# Altium project XTRXr5.PRJPCB (part 1 of 2)
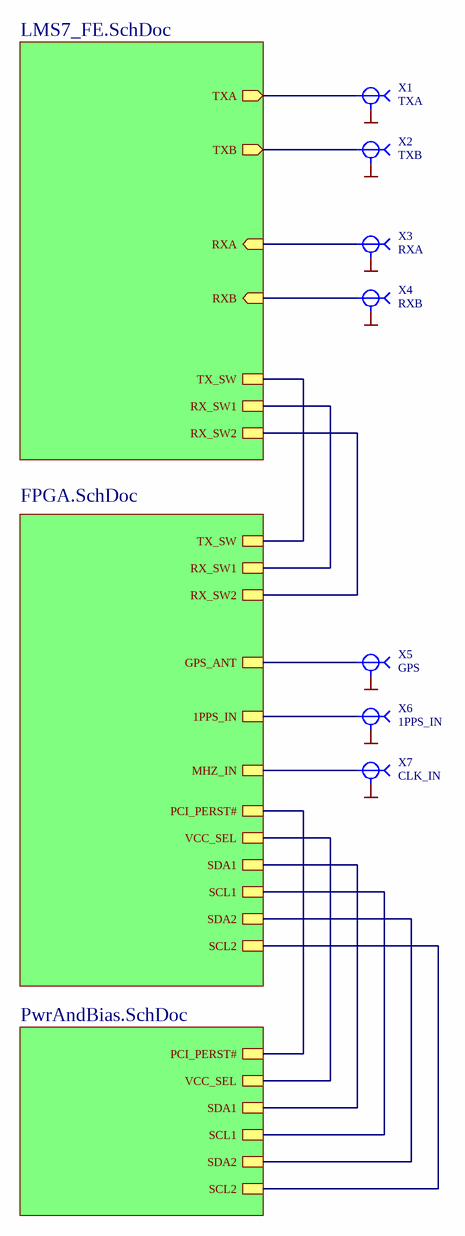
[diagram p0: Total.SchDoc]
ProjectRevision: 5
4 sheets, 367 parts. Net scope: hierarchical (ports join the sheet entries above them; power ports are global).
Board file: XTRXr5.PcbDoc
Sheets:
  Total.SchDoc
    PwrAndBias = PwrAndBias.SchDoc
    FPGA = FPGA.SchDoc
  Func Diagram.SchDoc

## Sheet Total.SchDoc: XTRX. SDR mini PCIe Transceiver.
size A4 portrait; CompanyName: Fairwaves Inc; DrawnBy: Andrey Sviyazov; Revision: 4; SheetNumber: 2; SheetTotal: 5

### Parts
X1  Label: TXA  [U_FL]
X2  Label: TXB  [U_FL]
X3  Label: RXA  [U_FL]
X4  Label: RXB  [U_FL]
X5  Label: GPS  [U_FL]
X6  Label: 1PPS_IN  [U_FL]
X7  Label: CLK_IN  [U_FL]

### Sub-sheets
FPGA = FPGA.SchDoc: 1PPS_IN, GPS_ANT, MHZ_IN, RX_SW1, RX_SW2, TX_SW, SCL1, SDA1, SDA2, SCL2, VCC_SEL, PCI_PERST#
LMS7_FE = LMS7_FE.SchDoc (file not in this document): TXB (out), TXA (out), RXB (in), RXA (in), RX_SW1, RX_SW2, TX_SW
PwrAndBias = PwrAndBias.SchDoc: SCL1, SDA1, SDA2, SCL2, VCC_SEL, PCI_PERST#

### Nets
GND: X1.2(GND) X2.2(GND) X3.2(GND) X4.2(GND) X5.2(GND) X6.2(GND) X7.2(GND)
1PPS_IN: X6.1 ; sheet FPGA/1PPS_IN
GPS_ANT: X5.1 ; sheet FPGA/GPS_ANT
MHZ_IN: X7.1 ; sheet FPGA/MHZ_IN
PCI_PERST#: sheet PwrAndBias/PCI_PERST#, sheet FPGA/PCI_PERST#
RX_SW1: sheet FPGA/RX_SW1, sheet LMS7_FE/RX_SW1
RX_SW2: sheet FPGA/RX_SW2, sheet LMS7_FE/RX_SW2
SCL1: sheet PwrAndBias/SCL1, sheet FPGA/SCL1
SCL2: sheet PwrAndBias/SCL2, sheet FPGA/SCL2
SDA1: sheet PwrAndBias/SDA1, sheet FPGA/SDA1
SDA2: sheet PwrAndBias/SDA2, sheet FPGA/SDA2
TX_SW: sheet FPGA/TX_SW, sheet LMS7_FE/TX_SW
VCC_SEL: sheet PwrAndBias/VCC_SEL, sheet FPGA/VCC_SEL
NetX1_1: X1.1 ; sheet LMS7_FE/TXA
NetX2_1: X2.1 ; sheet LMS7_FE/TXB
NetX3_1: X3.1 ; sheet LMS7_FE/RXA
NetX4_1: X4.1 ; sheet LMS7_FE/RXB

### Library data of the parts
X1-X7 = U_FL: Connector (UMCC); Manufacturer: Molex; Name: UFL; Value: 0734120110; Link: https://octopart.com/0734120110-molex-16756629

## Sheet PwrAndBias.SchDoc: XTRX. SDR mini PCIe Transceiver.
size A3; CompanyName: Fairwaves Inc.; DrawnBy: Andrey Sviyazov; Revision: 4; SheetNumber: 4; SheetTotal: 5
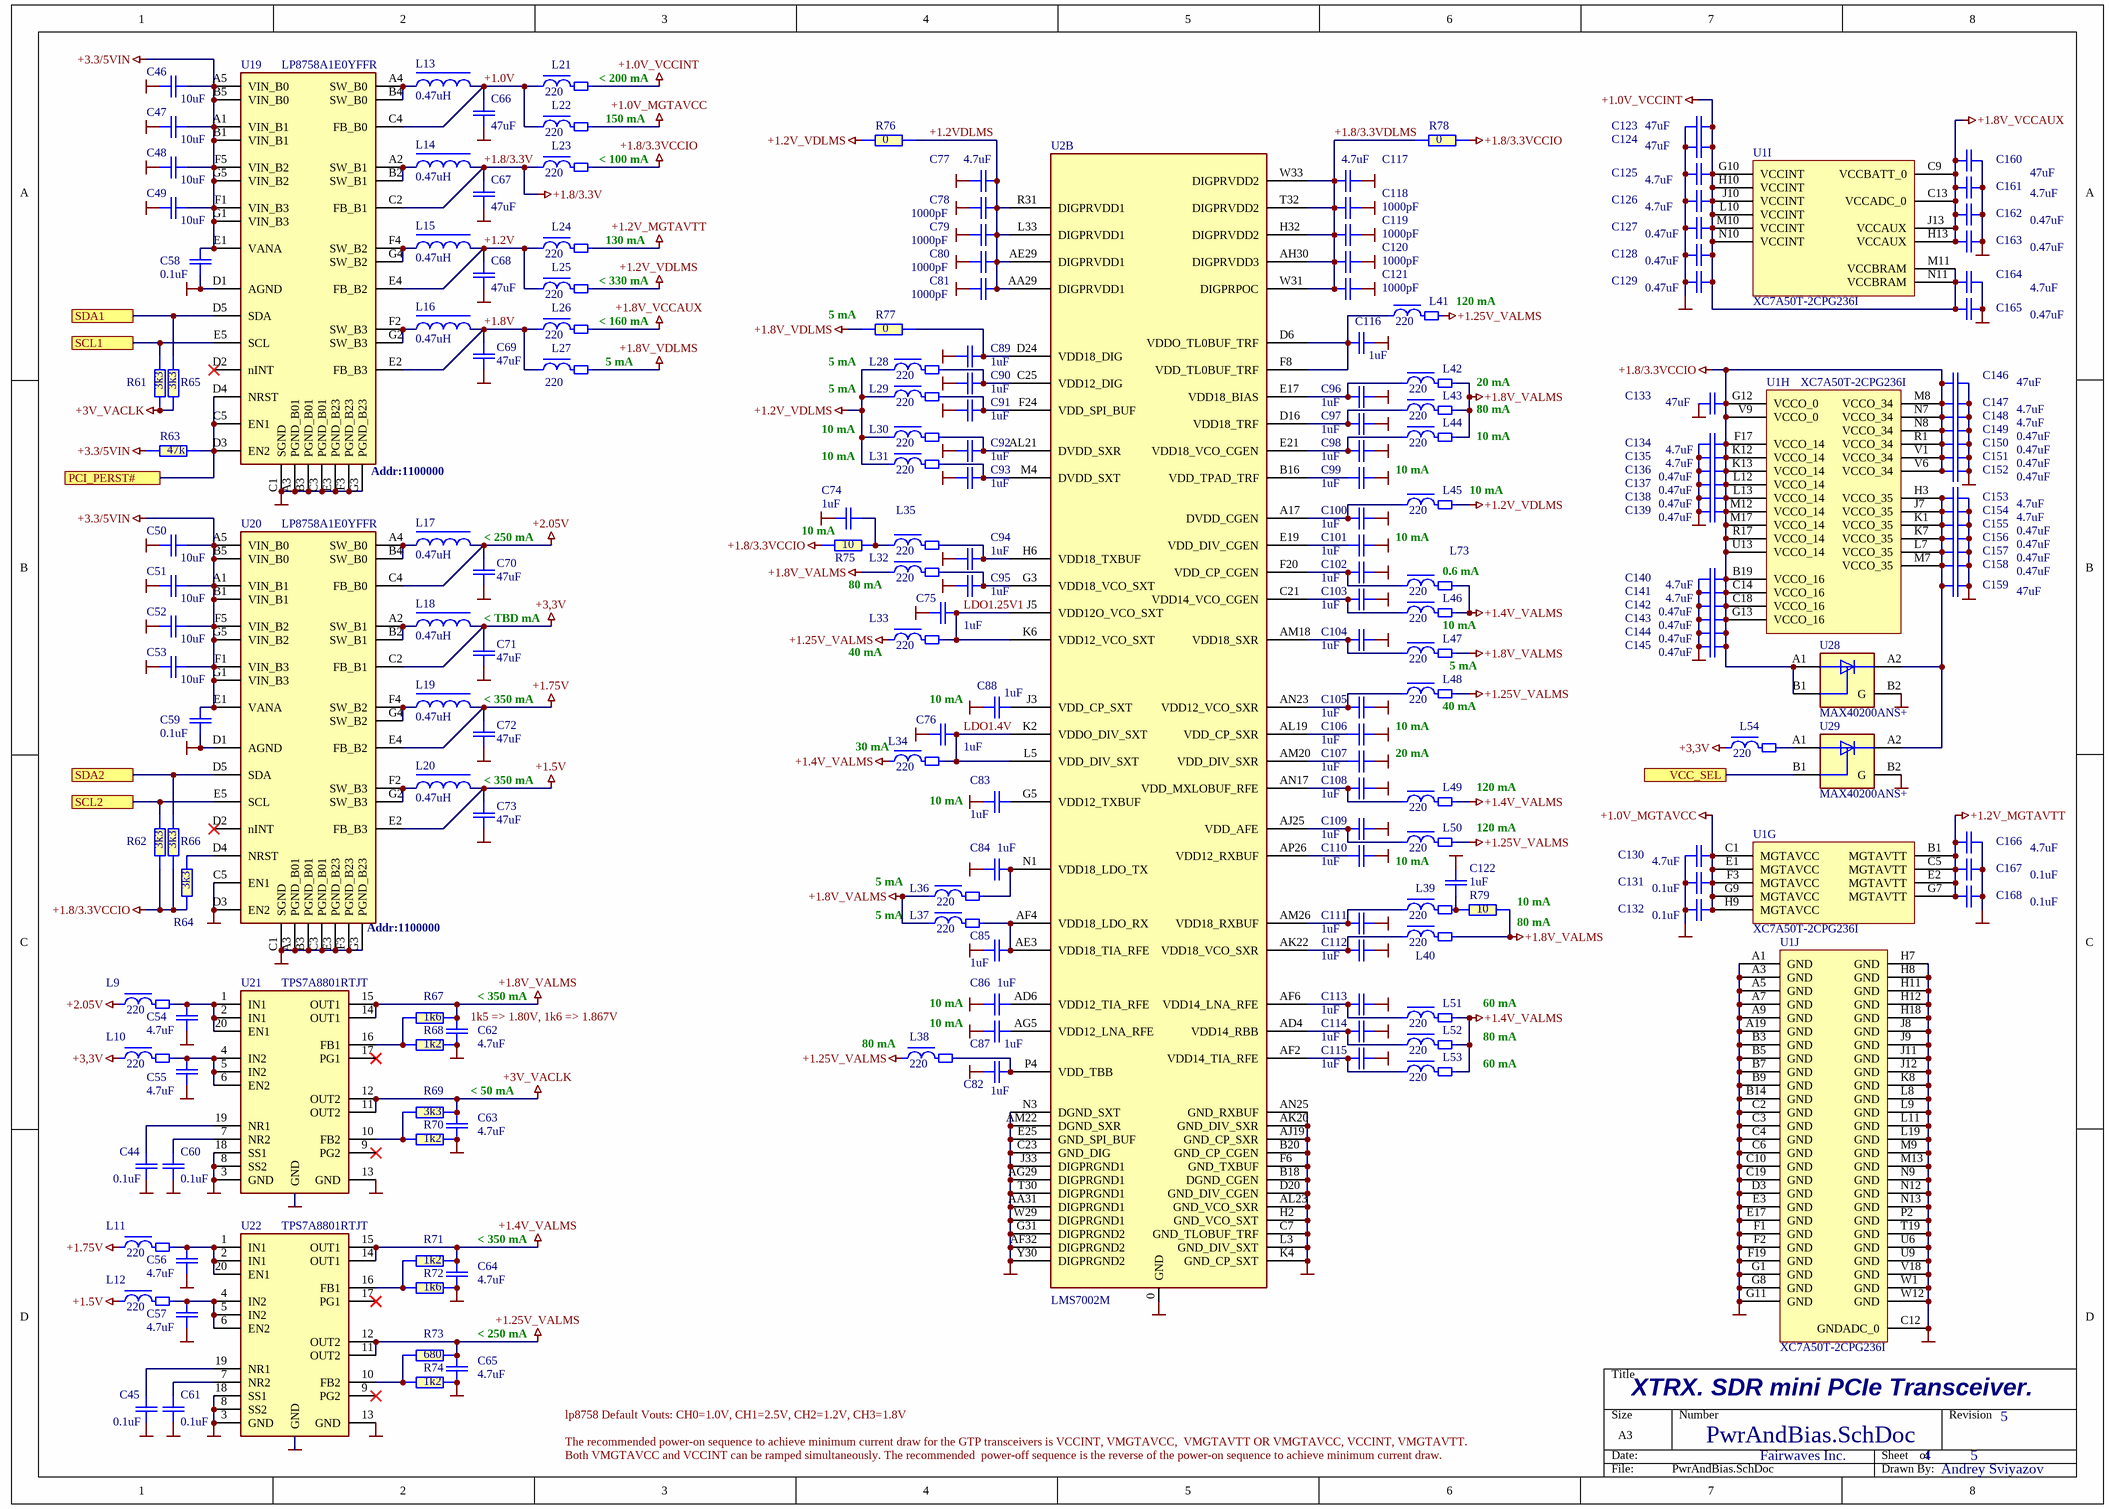
[diagram p1: PwrAndBias.SchDoc]

### Parts
C44  0.1uF  [C0402-cirq]
C45  0.1uF  [C0402-cirq]
C46  10uF  [C0603-Phillips]
C47  10uF  [C0603-Phillips]
C48  10uF  [C0603-Phillips]
C49  10uF  [C0603-Phillips]
C50  10uF  [C0603-Phillips]
C51  10uF  [C0603-Phillips]
C52  10uF  [C0603-Phillips]
C53  10uF  [C0603-Phillips]
C54  4.7uF  [C0402-cirq]
C55  4.7uF  [C0402-cirq]
C56  4.7uF  [C0402-cirq]
C57  4.7uF  [C0402-cirq]
C58  0.1uF  [C0402-cirq]
C59  0.1uF  [C0402-cirq]
C60  0.1uF  [C0402-cirq]
C61  0.1uF  [C0402-cirq]
C62  4.7uF  [C0402-cirq]
C63  4.7uF  [C0402-cirq]
C64  4.7uF  [C0402-cirq]
C65  4.7uF  [C0402-cirq]
C66  47uF  [C0603 tall]
C67  47uF  [C0603 tall]
C68  47uF  [C0603 tall]
C69  47uF  [C0603 tall]
C70  47uF  [C0603 tall]
C71  47uF  [C0603 tall]
C72  47uF  [C0603 tall]
C73  47uF  [C0603 tall]
C74  1uF  [C0402-cirq]
C75  1uF  [C0402-cirq]
C76  1uF  [C0402-cirq]
C77  4.7uF  [C0402-cirq]
C78  1000pF  [C0402-cirq]
C79  1000pF  [C0402-cirq]
C80  1000pF  [C0402-cirq]
C81  1000pF  [C0402-cirq]
C82  1uF  [C0402-cirq]
C83  1uF  [C0402-cirq]
C84  1uF  [C0402-cirq]
C85  1uF  [C0402-cirq]
C86  1uF  [C0402-cirq]
C87  1uF  [C0402-cirq]
C88  1uF  [C0402-cirq]
C89  1uF  [C0402-cirq]
C90  1uF  [C0402-cirq]
C91  1uF  [C0402-cirq]
C92  1uF  [C0402-cirq]
C93  1uF  [C0402-cirq]
C94  1uF  [C0402-cirq]
C95  1uF  [C0402-cirq]
C96  1uF  [C0402-cirq]
C97  1uF  [C0402-cirq]
C98  1uF  [C0402-cirq]
C99  1uF  [C0402-cirq]
C100  1uF  [C0402-cirq]
C101  1uF  [C0402-cirq]
C102  1uF  [C0402-cirq]
C103  1uF  [C0402-cirq]
C104  1uF  [C0402-cirq]
C105  1uF  [C0402-cirq]
C106  1uF  [C0402-cirq]
C107  1uF  [C0402-cirq]
C108  1uF  [C0402-cirq]
C109  1uF  [C0402-cirq]
C110  1uF  [C0402-cirq]
C111  1uF  [C0402-cirq]
C112  1uF  [C0402-cirq]
C113  1uF  [C0402-cirq]
C114  1uF  [C0402-cirq]
C115  1uF  [C0402-cirq]
C116  1uF  [C0402-cirq]
C117  4.7uF  [C0402-cirq]
C118  1000pF  [C0402-cirq]
C119  1000pF  [C0402-cirq]
C120  1000pF  [C0402-cirq]
C121  1000pF  [C0402-cirq]
C122  1uF  [C0402-cirq]
C123  47uF  [C0603 tall]
C124  47uF  [C0603 tall]
C125  4.7uF  [C0402-cirq]
C126  4.7uF  [C0402-cirq]
C127  0.47uF  [C0402-cirq]
C128  0.47uF  [C0402-cirq]
C129  0.47uF  [C0402-cirq]
C130  4.7uF  [C0402-cirq]
C131  0.1uF  [C0402-cirq]
C132  0.1uF  [C0402-cirq]
C133  47uF  [C0603 tall]
C134  4.7uF  [C0402-cirq]
C135  4.7uF  [C0402-cirq]
C136  0.47uF  [C0402-cirq]
C137  0.47uF  [C0402-cirq]
C138  0.47uF  [C0402-cirq]
C139  0.47uF  [C0402-cirq]
C140  4.7uF  [C0402-cirq]
C141  4.7uF  [C0402-cirq]
C142  0.47uF  [C0402-cirq]
C143  0.47uF  [C0402-cirq]
C144  0.47uF  [C0402-cirq]
C145  0.47uF  [C0402-cirq]
C146  47uF  [C0603 tall]
C147  4.7uF  [C0402-cirq]
C148  4.7uF  [C0402-cirq]
C149  0.47uF  [C0402-cirq]
C150  0.47uF  [C0402-cirq]
C151  0.47uF  [C0402-cirq]
C152  0.47uF  [C0402-cirq]
C153  4.7uF  [C0402-cirq]
C154  4.7uF  [C0402-cirq]
C155  0.47uF  [C0402-cirq]
C156  0.47uF  [C0402-cirq]
C157  0.47uF  [C0402-cirq]
C158  0.47uF  [C0402-cirq]
C159  47uF  [C0603 tall]
C160  47uF  [C0603 tall]
C161  4.7uF  [C0402-cirq]
C162  0.47uF  [C0402-cirq]
C163  0.47uF  [C0402-cirq]
C164  4.7uF  [C0402-cirq]
C165  0.47uF  [C0402-cirq]
C166  4.7uF  [C0402-cirq]
C167  0.1uF  [C0402-cirq]
C168  0.1uF  [C0402-cirq]
L9  220  [BEAD0402-Phillips]
L10  220  [BEAD0402-Phillips]
L11  220  [BEAD0402-Phillips]
L12  220  [BEAD0402-Phillips]
L13  0.47uH  [L-VLS201610HBX]
L14  0.47uH  [L-VLS201610HBX]
L15  0.47uH  [L-VLS201610HBX]
L16  0.47uH  [L-VLS201610HBX]
L17  0.47uH  [L-VLS201610HBX]
L18  0.47uH  [L-VLS201610HBX]
L19  0.47uH  [L-VLS201610HBX]
L20  0.47uH  [L-VLS201610HBX]
L21  220  [BEAD0402-Phillips]
L22  220  [BEAD0402-Phillips]
L23  220  [BEAD0402-Phillips]
L24  220  [BEAD0402-Phillips]
L25  220  [BEAD0402-Phillips]
L26  220  [BEAD0402-Phillips]
L27  220  [BEAD0402-Phillips]
L28  220  [BEAD0402-Phillips]
L29  220  [BEAD0402-Phillips]
L30  220  [BEAD0402-Phillips]
L31  220  [BEAD0402-Phillips]
L32  220  [BEAD0402-Phillips]
L33  220  [BEAD0402-Phillips]
L34  220  [BEAD0402-Phillips]
L35  220  [BEAD0402-Phillips]
L36  220  [BEAD0402-Phillips]
L37  220  [BEAD0402-Phillips]
L38  220  [BEAD0402-Phillips]
L39  220  [BEAD0402-Phillips]
L40  220  [BEAD0402-Phillips]
L41  220  [BEAD0402-Phillips]
L42  220  [BEAD0402-Phillips]
L43  220  [BEAD0402-Phillips]
L44  220  [BEAD0402-Phillips]
L45  220  [BEAD0402-Phillips]
L46  220  [BEAD0402-Phillips]
L47  220  [BEAD0402-Phillips]
L48  220  [BEAD0402-Phillips]
L49  220  [BEAD0402-Phillips]
L50  220  [BEAD0402-Phillips]
L51  220  [BEAD0402-Phillips]
L52  220  [BEAD0402-Phillips]
L53  220  [BEAD0402-Phillips]
L54  220  [BEAD0402-Phillips]
L73  220  [BEAD0402-Phillips]
R61  3k3  [R0402-Phillips]
R62  3k3  [R0402-Phillips]
R63  47k  [R0402-Phillips]
R64  3k3  [R0402-Phillips]
R65  3k3  [R0402-Phillips]
R66  3k3  [R0402-Phillips]
R67  1k6  [R0402-Phillips]
R68  1k2  [R0402-Phillips]
R69  3k3  [R0402-Phillips]
R70  1k2  [R0402-Phillips]
R71  1k2  [R0402-Phillips]
R72  1k6  [R0402-Phillips]
R73  680  [R0402-Phillips]
R74  1k2  [R0402-Phillips]
R75  10  [R0402-Phillips]
R76  0  [R0402-Phillips]
R77  0  [R0402-Phillips]
R78  0  [R0402-Phillips]
R79  10  [R0402-Phillips]
U1  XC7A50T-2CPG236I  [CPG236]  (parts G,H,I,J of 10)
U2  LMS7002M  [aQFN260(11.5x11.5mm)]  (part B of 5)
U19  LP8758A1E0YFFR  [BGA WLCSP35]
U20  LP8758A1E0YFFR  [BGA WLCSP35]
U21  TPS7A8801RTJT  [QFN-20(4X4/0.5)TI]
U22  TPS7A8801RTJT  [QFN-20(4X4/0.5)TI]
U28  MAX40200ANS+  [BGA WLP4 (0.7x0.7/0.35)]
U29  MAX40200ANS+  [BGA WLP4 (0.7x0.7/0.35)]

### Ports
PCI_PERST#, SCL1, SCL2, SDA1, SDA2, VCC_SEL

### Nets
+1.0V_MGTAVCC: C130.2 C131.1 C132.1 L22.2 U1.C1(MGTAVCC) U1.E1(MGTAVCC) U1.F3(MGTAVCC) U1.G9(MGTAVCC) U1.H9(MGTAVCC)
+1.0V_VCCINT: C123.2 C124.2 C125.1 C126.1 C127.1 C128.1 C129.1 C164.1 C165.1 L21.2 U1.G10(VCCINT) U1.H10(VCCINT) U1.J10(VCCINT) U1.L10(VCCINT) U1.M10(VCCINT) U1.M11(VCCBRAM) U1.N10(VCCINT) U1.N11(VCCBRAM)
+1.2V_MGTAVTT: C166.1 C167.1 C168.1 L24.2 U1.B1(MGTAVTT) U1.C5(MGTAVTT) U1.E2(MGTAVTT) U1.G7(MGTAVTT)
+1.2V_VDLMS: L25.2 L28.1 L29.1 L30.1 L31.1 L45.2 R76.1
+1.4V_VALMS: C64.2 L34.1 L46.2 L49.2 L51.2 L52.2 L53.2 L73.2 R71.2 U22.14(OUT1) U22.15(OUT1)
+1.5V: C73.2 L12.1 L20.2 U20.E2(FB_B3)
+1.8/3.3V: C67.2 L14.2 L23.1 U19.C2(FB_B1)
+1.8/3.3VCCIO: C133.2 C134.1 C135.1 C136.1 C137.1 C138.1 C139.1 C140.1 C141.1 C142.1 C143.1 C144.1 C145.1 C146.1 C147.1 C148.1 C149.1 C150.1 C151.1 C152.1 L23.2 R62.1 R64.1 R66.1 R75.1 R78.2 U1.B19(VCCO_16) U1.C14(VCCO_16) U1.C18(VCCO_16) U1.F17(VCCO_14) U1.G12(VCCO_0) U1.G13(VCCO_16) U1.K12(VCCO_14) U1.K13(VCCO_14) U1.L12(VCCO_14) U1.L13(VCCO_14) U1.M8(VCCO_34) U1.M12(VCCO_14) U1.M17(VCCO_14) U1.N7(VCCO_34) U1.N8(VCCO_34) U1.R1(VCCO_34) U1.R17(VCCO_14) U1.U13(VCCO_14) U1.V1(VCCO_34) U1.V6(VCCO_34) U1.V9(VCCO_0) U28.A1(VDD) U28.B1(EN)
+1.8V_VALMS: C62.2 L32.1 L36.1 L37.1 L40.2 L42.2 L43.2 L44.2 L47.2 R67.2 R79.2 U21.14(OUT1) U21.15(OUT1)
+1.8V_VCCAUX: C160.1 C161.1 C162.1 C163.1 L26.2 U1.C9(VCCBATT_0) U1.C13(VCCADC_0) U1.H13(VCCAUX) U1.J13(VCCAUX)
+1.8V_VDLMS: L27.2 R77.1
+1.25V_VALMS: C65.2 L33.1 L38.1 L41.2 L48.2 L50.2 R73.2 U22.11(OUT2) U22.12(OUT2)
+1.75V: C72.2 L11.1 L19.2 U20.E4(FB_B2)
+2.05V: C70.2 L9.1 L17.2 U20.C4(FB_B0)
+3,3V: C71.2 L10.1 L18.2 L54.1 U20.C2(FB_B1)
+3.3/5VIN: C46.2 C47.2 C48.2 C49.2 C50.2 C51.2 C52.2 C53.2 C58.2 C59.2 R63.1 U19.A1(VIN_B1) U19.A5(VIN_B0) U19.B1(VIN_B1) U19.B5(VIN_B0) U19.E1(VANA) U19.F1(VIN_B3) U19.F5(VIN_B2) U19.G1(VIN_B3) U19.G5(VIN_B2) U20.A1(VIN_B1) U20.A5(VIN_B0) U20.B1(VIN_B1) U20.B5(VIN_B0) U20.E1(VANA) U20.F1(VIN_B3) U20.F5(VIN_B2) U20.G1(VIN_B3) U20.G5(VIN_B2)
+3V_VACLK: C63.2 R61.1 R65.1 R69.2 U21.11(OUT2) U21.12(OUT2)
GND: C44.1 C45.1 C46.1 C47.1 C48.1 C49.1 C50.1 C51.1 C52.1 C53.1 C54.1 C55.1 C56.1 C57.1 C58.1 C59.1 C60.1 C61.1 C62.1 C63.1 C64.1 C65.1 C66.2 C67.1 C68.2 C69.1 C70.1 C71.1 C72.1 C73.1 C74.1 C75.1 C76.1 C77.1 C78.1 C79.1 C80.1 C81.1 C82.1 C83.1 C84.1 C85.1 C86.1 C87.1 C88.1 C89.1 C90.1 C91.1 C92.1 C93.1 C94.1 C95.1 C96.2 C97.2 C98.2 C99.2 C100.2 C101.2 C102.2 C103.2 C104.2 C105.2 C106.2 C107.2 C108.2 C109.2 C110.2 C111.2 C112.2 C113.2 C114.2 C115.2 C116.2 C117.2 C118.1 C119.1 C120.1 C121.1 C122.2 C123.1 C124.1 C125.2 C126.2 C127.2 C128.2 C129.2 C130.1 C131.2 C132.2 C133.1 C134.2 C135.2 C136.2 C137.2 C138.2 C139.2 C140.2 C141.2 C142.2 C143.2 C144.2 C145.2 C146.2 C147.2 C148.2 C149.2 C150.2 C151.2 C152.2 C153.2 C154.2 C155.2 C156.2 C157.2 C158.2 C159.2 C160.2 C161.2 C162.2 C163.2 C164.2 C165.2 C166.2 C167.2 C168.2 R68.2 R70.2 R72.2 R74.2 U1.A1(GND) U1.A3(GND) U1.A5(GND) U1.A7(GND) U1.A9(GND) U1.A19(GND) U1.B3(GND) U1.B5(GND) U1.B7(GND) U1.B9(GND) U1.B14(GND) U1.C2(GND) U1.C3(GND) U1.C4(GND) U1.C6(GND) U1.C10(GND) U1.C12(GNDADC_0) U1.C19(GND) U1.D3(GND) U1.E3(GND) U1.E17(GND) U1.F1(GND) U1.F2(GND) U1.F19(GND) U1.G1(GND) U1.G8(GND) U1.G11(GND) U1.H7(GND) U1.H8(GND) U1.H11(GND) U1.H12(GND) U1.H18(GND) U1.J8(GND) U1.J9(GND) U1.J11(GND) U1.J12(GND) U1.K8(GND) U1.L8(GND) U1.L9(GND) U1.L11(GND) U1.L19(GND) U1.M9(GND) U1.M13(GND) U1.N9(GND) U1.N12(GND) U1.N13(GND) U1.P2(GND) U1.T19(GND) U1.U6(GND) U1.U9(GND) U1.V18(GND) U1.W1(GND) U1.W12(GND) U2.0(GND) U2.AA31(DIGPRGND1) U2.AF32(DIGPRGND2) U2.AG29(DIGPRGND1) U2.AJ19(GND_CP_SXR) U2.AK20(GND_DIV_SXR) U2.AL23(GND_VCO_SXR) U2.AM22(DGND_SXR) U2.AN25(GND_RXBUF) U2.B18(DGND_CGEN) U2.B20(GND_CP_CGEN) U2.C7(GND_TLOBUF_TRF) U2.C23(GND_DIG) U2.D20(GND_DIV_CGEN) U2.E25(GND_SPI_BUF) U2.F6(GND_TXBUF) U2.G31(DIGPRGND2) U2.H2(GND_VCO_SXT) U2.J33(DIGPRGND1) U2.K4(GND_CP_SXT) U2.L3(GND_DIV_SXT) U2.N3(DGND_SXT) U2.T30(DIGPRGND1) U2.W29(DIGPRGND1) U2.Y30(DIGPRGND2) U19.A3(PGND_B01) U19.B3(PGND_B01) U19.C1(SGND) U19.C3(PGND_B01) U19.D1(AGND) U19.E3(PGND_B23) U19.F3(PGND_B23) U19.G3(PGND_B23) U20.A3(PGND_B01) U20.B3(PGND_B01) U20.C1(SGND) U20.C3(PGND_B01) U20.C5(EN1) U20.D1(AGND) U20.D3(EN2) U20.E3(PGND_B23) U20.F3(PGND_B23) U20.G3(PGND_B23) U21.0(GND) U21.3(GND) U21.8(SS2) U21.13(GND) U21.18(SS1) U22.0(GND) U22.3(GND) U22.8(SS2) U22.13(GND) U22.18(SS1) U28.B2(G) U29.B2(G)
+1.0V: C66.1 L13.2 L21.1 L22.1 U19.C4(FB_B0)
+1.2V: C68.1 L15.2 L24.1 L25.1 U19.E4(FB_B2)
+1.2VDLMS: C77.2 C78.2 C79.2 C80.2 C81.2 R76.2 U2.AA29(DIGPRVDD1) U2.AE29(DIGPRVDD1) U2.L33(DIGPRVDD1) U2.R31(DIGPRVDD1)
+1.8/3.3VDLMS: C117.1 C118.2 C119.2 C120.2 C121.2 R78.1 U2.AH30(DIGPRVDD3) U2.H32(DIGPRVDD2) U2.T32(DIGPRVDD2) U2.W31(DIGPRPOC) U2.W33(DIGPRVDD2)
+1.8V: C69.2 L16.2 L26.1 L27.1 U19.E2(FB_B3)
LDO1.4V: C76.2 L34.2 U2.K2(VDDO_DIV_SXT) U2.L5(VDD_DIV_SXT)
LDO1.25V1: C75.2 L33.2 U2.J5(VDD12O_VCO_SXT) U2.K6(VDD12_VCO_SXT)
PCI_PERST#: R63.2 U19.C5(EN1) U19.D3(EN2) U19.D4(NRST) ; port PCI_PERST#
SCL1: R61.2 U19.E5(SCL) ; port SCL1
SCL2: R62.2 U20.E5(SCL) ; port SCL2
SDA1: R65.2 U19.D5(SDA) ; port SDA1
SDA2: R66.2 U20.D5(SDA) ; port SDA2
VCC_SEL: U29.B1(EN) ; port VCC_SEL
NetC44_2: C44.2 U21.19(NR1)
NetC45_2: C45.2 U22.19(NR1)
NetC54_2: C54.2 L9.2 U21.1(IN1) U21.2(IN1) U21.20(EN1)
NetC55_2: C55.2 L10.2 U21.4(IN2) U21.5(IN2) U21.6(EN2)
NetC56_2: C56.2 L11.2 U22.1(IN1) U22.2(IN1) U22.20(EN1)
NetC57_2: C57.2 L12.2 U22.4(IN2) U22.5(IN2) U22.6(EN2)
NetC60_2: C60.2 U21.7(NR2)
NetC61_2: C61.2 U22.7(NR2)
NetC74_2: C74.2 L35.1 R75.2
NetC82_2: C82.2 L38.2 U2.P4(VDD_TBB)
NetC83_2: C83.2 U2.G5(VDD12_TXBUF)
NetC84_2: C84.2 L36.2 U2.N1(VDD18_LDO_TX)
NetC85_2: C85.2 L37.2 U2.AE3(VDD18_TIA_RFE) U2.AF4(VDD18_LDO_RX)
NetC86_2: C86.2 U2.AD6(VDD12_TIA_RFE)
NetC87_2: C87.2 U2.AG5(VDD12_LNA_RFE)
NetC88_2: C88.2 U2.J3(VDD_CP_SXT)
NetC89_2: C89.2 R77.2 U2.D24(VDD18_DIG)
NetC90_2: C90.2 L28.2 U2.C25(VDD12_DIG)
NetC91_2: C91.2 L29.2 U2.F24(VDD_SPI_BUF)
NetC92_2: C92.2 L30.2 U2.AL21(DVDD_SXR)
NetC93_2: C93.2 L31.2 U2.M4(DVDD_SXT)
NetC94_2: C94.2 L35.2 U2.H6(VDD18_TXBUF)
NetC95_2: C95.2 L32.2 U2.G3(VDD18_VCO_SXT)
NetC96_1: C96.1 L42.1 U2.E17(VDD18_BIAS)
NetC97_1: C97.1 L43.1 U2.D16(VDD18_TRF)
NetC98_1: C98.1 L44.1 U2.E21(VDD18_VCO_CGEN)
NetC99_1: C99.1 U2.B16(VDD_TPAD_TRF)
NetC100_1: C100.1 L45.1 U2.A17(DVDD_CGEN)
NetC101_1: C101.1 U2.E19(VDD_DIV_CGEN)
NetC102_1: C102.1 L73.1 U2.F20(VDD_CP_CGEN)
NetC103_1: C103.1 L46.1 U2.C21(VDD14_VCO_CGEN)
NetC104_1: C104.1 L47.1 U2.AM18(VDD18_SXR)
NetC105_1: C105.1 L48.1 U2.AN23(VDD12_VCO_SXR)
NetC106_1: C106.1 U2.AL19(VDD_CP_SXR)
NetC107_1: C107.1 U2.AM20(VDD_DIV_SXR)
NetC108_1: C108.1 L49.1 U2.AN17(VDD_MXLOBUF_RFE)
NetC109_1: C109.1 L50.1 U2.AJ25(VDD_AFE)
NetC110_1: C110.1 U2.AP26(VDD12_RXBUF)
NetC111_1: C111.1 L39.1 U2.AM26(VDD18_RXBUF)
NetC112_1: C112.1 L40.1 U2.AK22(VDD18_VCO_SXR)
NetC113_1: C113.1 L51.1 U2.AF6(VDD14_LNA_RFE)
NetC114_1: C114.1 L52.1 U2.AD4(VDD14_RBB)
NetC115_1: C115.1 L53.1 U2.AF2(VDD14_TIA_RFE)
NetC116_1: C116.1 L41.1 U2.D6(VDDO_TL0BUF_TRF) U2.F8(VDD_TL0BUF_TRF)
NetC122_1: C122.1 L39.2 R79.1
NetC153_1: C153.1 C154.1 C155.1 C156.1 C157.1 C158.1 C159.1 U1.H3(VCCO_35) U1.J7(VCCO_35) U1.K1(VCCO_35) U1.K7(VCCO_35) U1.L7(VCCO_35) U1.M7(VCCO_35) U28.A2(OUT) U29.A2(OUT)
NetL13_1: L13.1 U19.A4(SW_B0) U19.B4(SW_B0)
NetL14_1: L14.1 U19.A2(SW_B1) U19.B2(SW_B1)
NetL15_1: L15.1 U19.F4(SW_B2) U19.G4(SW_B2)
NetL16_1: L16.1 U19.F2(SW_B3) U19.G2(SW_B3)
NetL17_1: L17.1 U20.A4(SW_B0) U20.B4(SW_B0)
NetL18_1: L18.1 U20.A2(SW_B1) U20.B2(SW_B1)
NetL19_1: L19.1 U20.F4(SW_B2) U20.G4(SW_B2)
NetL20_1: L20.1 U20.F2(SW_B3) U20.G2(SW_B3)
NetL54_2: L54.2 U29.A1(VDD)
NetR64_2: R64.2 U20.D4(NRST)
NetR67_1: R67.1 R68.1 U21.16(FB1)
NetR69_1: R69.1 R70.1 U21.10(FB2)
NetR71_1: R71.1 R72.1 U22.16(FB1)
NetR73_1: R73.1 R74.1 U22.10(FB2)

Not connected (* = marked no-connect by the designer): U19 D2(nINT)*; U20 D2(nINT)*; U21 9(PG2)* 17(PG1)*; U22 9(PG2)* 17(PG1)*

### Notes on the sheet
- (near L21) < 200 mA
- (near L23) < 100 mA
- (near L22) 150 mA
- (near L24) 130 mA
- (near L25) < 330 mA
- (near R77) 5 mA
- (near L41) 120 mA
- (near L26) < 160 mA
- (near L27) 5 mA
- 5 mA
- 10 mA
- 20 mA
- 80 mA
- (near U19) Addr:1100000
- (near L45) 10 mA
- < 250 mA
- (near L32) 80 mA
- (near L73) 0.6 mA
- < TBD mA
- (near L46) 10 mA
- < 350 mA
- (near L33) 40 mA
- (near L48) 40 mA
- (near L47) 5 mA
- (near L34) 30 mA
- (near L49) 120 mA
- 120 mA
- (near R79) 10 mA
- (near U20) Addr:1100000
- (near R79) 80 mA
- 1k5 => 1.80V, 1k6 => 1.867V
- (near L38) 80 mA
- 60 mA
- < 50 mA
- The recommended power-on sequence to achieve minimum current draw for the GTP transceivers is VCCINT, VMGTAVCC,  VMGTAVTT OR VMGTAVCC, VCCINT, VMGTAVTT.
- Both VMGTAVCC and VCCINT can be ramped simultaneously. The recommended  power-off sequence is the reverse of the power-on sequence to achieve minimum current draw.
- lp8758 Default Vouts: CH0=1.0V, CH1=2.5V, CH2=1.2V, CH3=1.8V

### Library data of the parts
C44 C45 C58-C61 C131 C132 C167 C168 = C0402: Capacitor; Manufacturer: Any; Tolerance: 20%; Name: SMD0402; U/P/TKE: X7R 16V; Value: 0.1uF; Link: https://octopart.com/search?avg_avail=%281__%2A%29&q=GRM155+x7r+0.1uf+0402&r=sp&s=NUEPno7bQ4qfu1XPud9uDg&start=10
C46-C53 = C0603: Capacitor; Manufacturer: Any; Tolerance: 20%; U/P/TKE: X5R 6.3V; Value: 10uF; Link: https://octopart.com/search?avg_avail=(1__*)&q=10uF%20%20x5r%206.3v%200603&start=0
C54-C57 C62-C65 C77 C117 C125 C126 C130 C134 C135 C140 C141 C147 C148 C153 C154 C161 C164 C166 = C0402: Capacitor; Manufacturer: Any; Tolerance: 20%; Name: SMD0402; U/P/TKE: X5R 6.3V; Value: 4.7uF; Link: https://octopart.com/search?avg_avail=(1__*)&q=4.7uf%200402&start=0&specs2.76.numbers=4.7e-06
C66-C73 C123 C124 C133 C146 C159 C160 = C0603-TALL: Capacitor; Manufacturer: MuRata; Tolerance: 20%; Name: ZRB18AR60J476ME01L; U/P/TKE: X5R 6.3V; Value: 47uF; Link: https://octopart.com/zrb18ar60j476me01l-murata-71221023?r=sp&s=AX1jIhZnRzqCJDNKo8E3Og
C74-C76 C82-C116 C122 = C0402: Capacitor; Manufacturer: Any; Tolerance: 20%; Name: SMD0402; U/P/TKE: X5R 10V; Value: 1uF; Link: https://octopart.com/search?avg_avail=(1__*)&q=1uF%20%20x5r%200402&specs2.76.numbers=1e-06&start=0&oq=1uF%20%20x5r%200402
C78-C81 C118-C121 = C0402: Capacitor; Manufacturer: Any; Tolerance: 10%; Name: SMD0402; U/P/TKE: C0G NP0; Value: 1000pF; Link: https://octopart.com/search?avg_avail=(1__*)&q=1000PF%20C0G%20NP0%200402&start=0
C127-C129 C136-C139 C142-C145 C149-C152 C155-C158 C162 C163 C165 = C0402: Capacitor; Manufacturer: Any; Tolerance: 20%; Name: SMD0402; U/P/TKE: X5R 16V; Value: 0.47uF; Link: https://octopart.com/search?avg_avail=(1__*)&q=x5r%200.47uf%200402&r=sp&s=NUEPno7bQ4qfu1XPud9uDg&start=0
L9-L12 L21-L54 L73 = EMI BLM15: Ferrite bead EMIFIL; Manufacturer: MURATA; Name: BLM15EG221SN1; Value: 220; Link: https://octopart.com/blm15eg221sn1d-murata-368376
L13-L20 = L-VLS20161xHBX-1: Coil; Manufacturer: TDK; U/P/TKE: 2.8A/35mOhm; Name: VLS201610HBX-R47M-1; Value: 0.47uH; Link: https://octopart.com/vls201610hbx-r47m-1-tdk-52458594
R61-R79 = R0402: Resistor; Manufacturer: BOURNS; Tolerance: 5%; Name: CR0402-JW; U/P/TKE: 50V/60mW/200ppm
  R61 R62 R64-R66 R69: Value: 3k3
  R63: Value: 47k
  R67 R72: Value: 1k6
  R68 R70 R71 R74: Value: 1k2
  R73: Value: 680
  R75 R79: Value: 10
  R76-R78: Value: 0
U1 = XC7A35T-2CPG236C: Artix-7 FPGA; Manufacturer: Xilinx; Total Block RAM: 1800 Kb; GTP: 2; Clock Mgmt Tiles (CMTs): 5; Logic Cells: 33280; Available User I/O: 106; DatasheetVersion: v1.15; PackageVersion: Rev. 1.11; PackageReference: CPG-236; PackageDescription: 238-Ball Wire-Bond Chip-Scale BGA, Body 10 x10 mm, Pitch 0.5 mm; Maximum Distributed RAM: 400 Kb; Operating Temperature Range: Commercial; Speed Grades: 2; NexusDeviceID: XC7A35T-2CPG236C; Mounting Technology: Surface Mount; PartNumber: XC7A50T-2CPG236I; ComponentLink1Description: Manufacturer URL; ComponentLink1URL: http://www.xilinx.com/; ComponentLink2Description: Datasheet; ComponentLink2URL: http://www.xilinx.com/support/documentation/data_sheets/ds180_7Series_Overview.pdf; ComponentLink3Description: Package Specification; ComponentLink3URL: http://www.xilinx.com/support/documentation/user_guides/ug475_7Series_Pkg_Pinout.pdf; ComponentLink4Description: DC and Switching Characteristics; ComponentLink4URL: http://www.xilinx.com/support/documentation/data_sheets/ds181_Artix_7_Data_Sheet.pdf; ComponentLink5Description: Package File; ComponentLink5URL: http://www.xilinx.com/support/packagefiles/a7packages/xc7a200tsbg484pkg.txt; ComponentLink6Description: Packaging and Pinout; ComponentLink6URL: http://www.xilinx.com/support/documentation/user_guides/ug475_7Series_Pkg_Pinout.pdf
U2 = LMS7002M: FPRF MIMO Transceiver IC; Manufacturer: Lime Microsystems; Misc: Multi-band Multi-standard  Transceiver with Digital Interface; Name: LMS7002M
U19 U20 = LP8758-E0: IC 4xDC/DC; Manufacturer: TI; Misc: 4x  4A DC/DCs, i2c control; Swap: No; U/P/TKE: 2.5-5.5V to 0.5-3.3V; Name: LP8758A1E0YFFR; Link: https://octopart.com/lp8758a1e0yffr-texas+instruments-68058967
U21 U22 = TPS7A88: IC dual LDO extra low noise; Manufacturer: TI; Swap: No; U/P/TKE: 1.4-6.5V/Vdo<0.2V/NF<3.8uVrms; Name: TPS7A8801RTJT; Link: https://octopart.com/tps7a8801rtjt-texas+instruments-68059618
U28 U29 = MAX40200ANS+: IC ideal diode switch; Manufacturer: MAXIM; U/P/TKE: 1.5-5.5V/1A; Name: MAX40200ANS+; Misc: IC ideal diode switch; Value: MAX40200ANS+; Link: https://octopart.com/max40200ans%2Bt-maxim+integrated-80998950

## Sheet FPGA.SchDoc: XTRX. SDR mini PCIe Transceiver.
size A2; CompanyName: Fairwaves Inc.; DrawnBy: Andrey Sviyazov; Revision: 4; SheetNumber: 3; SheetTotal: 5
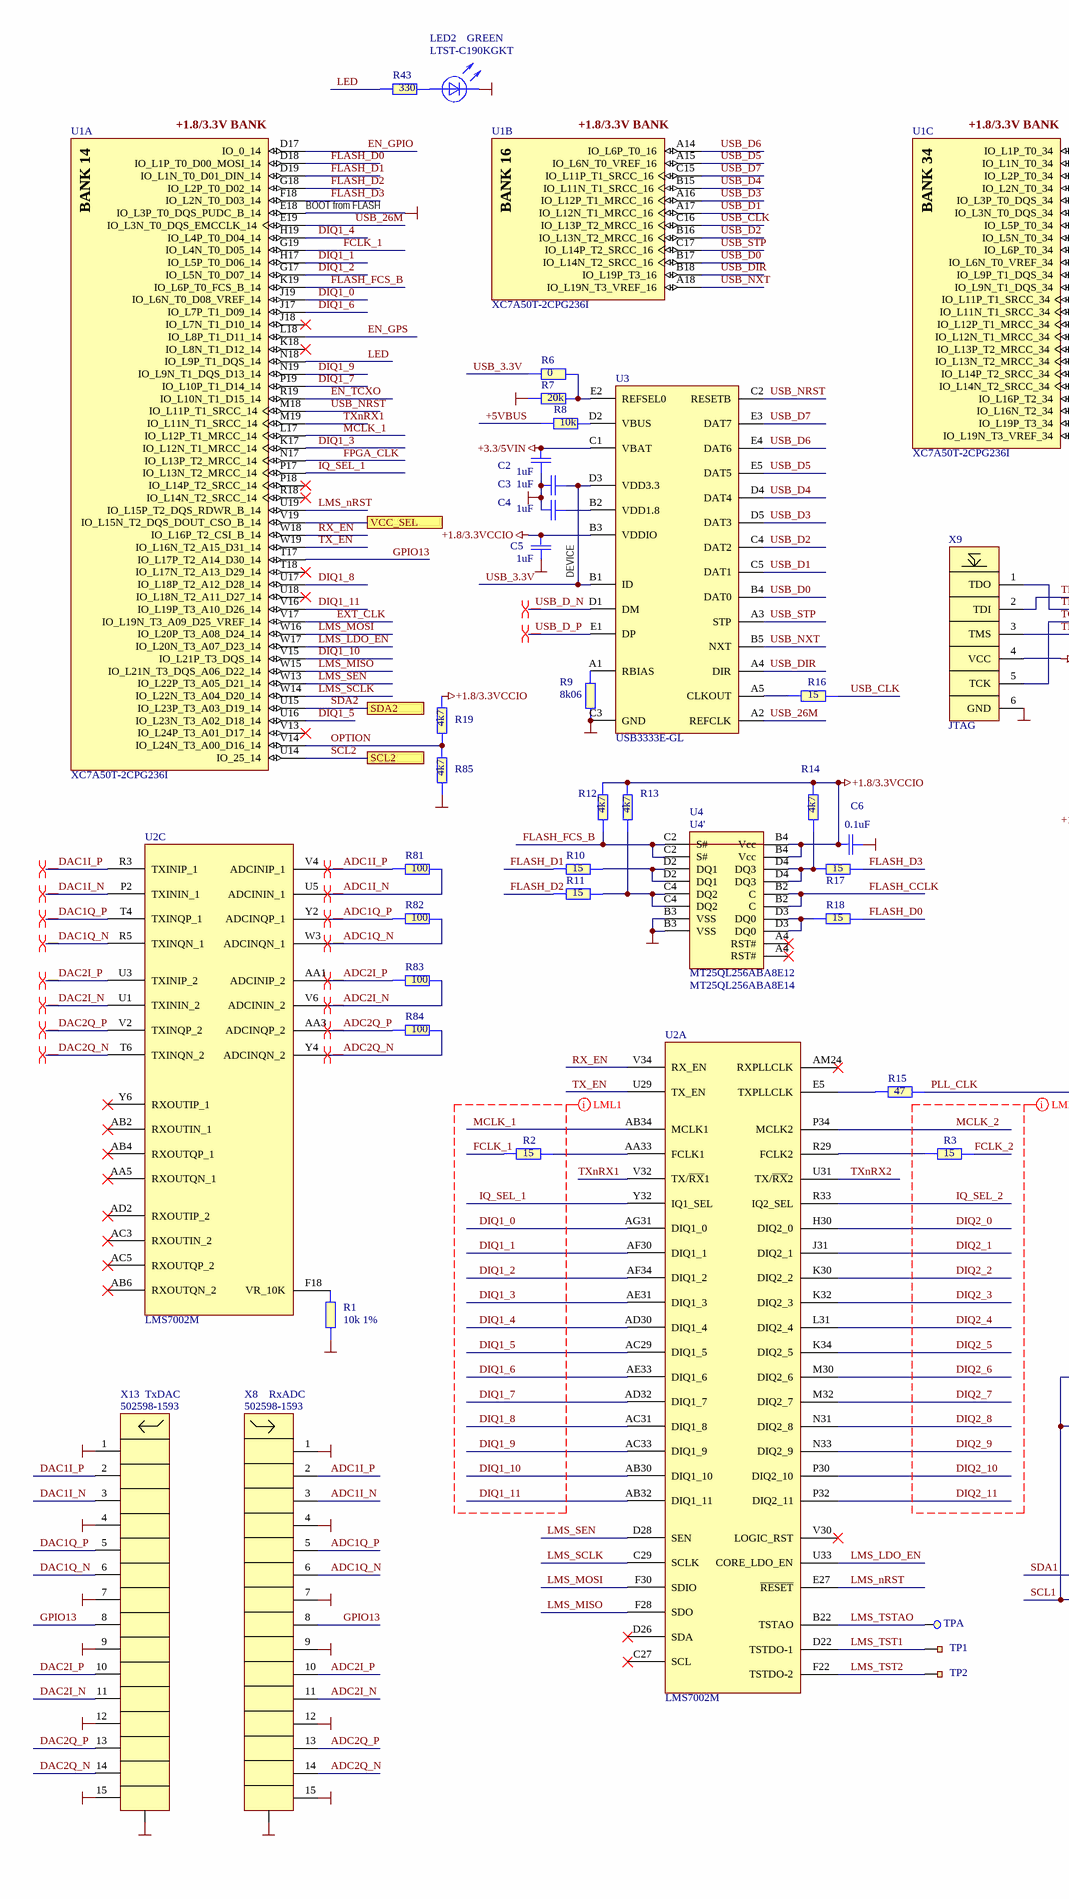
[diagram p2: FPGA.SchDoc, left]
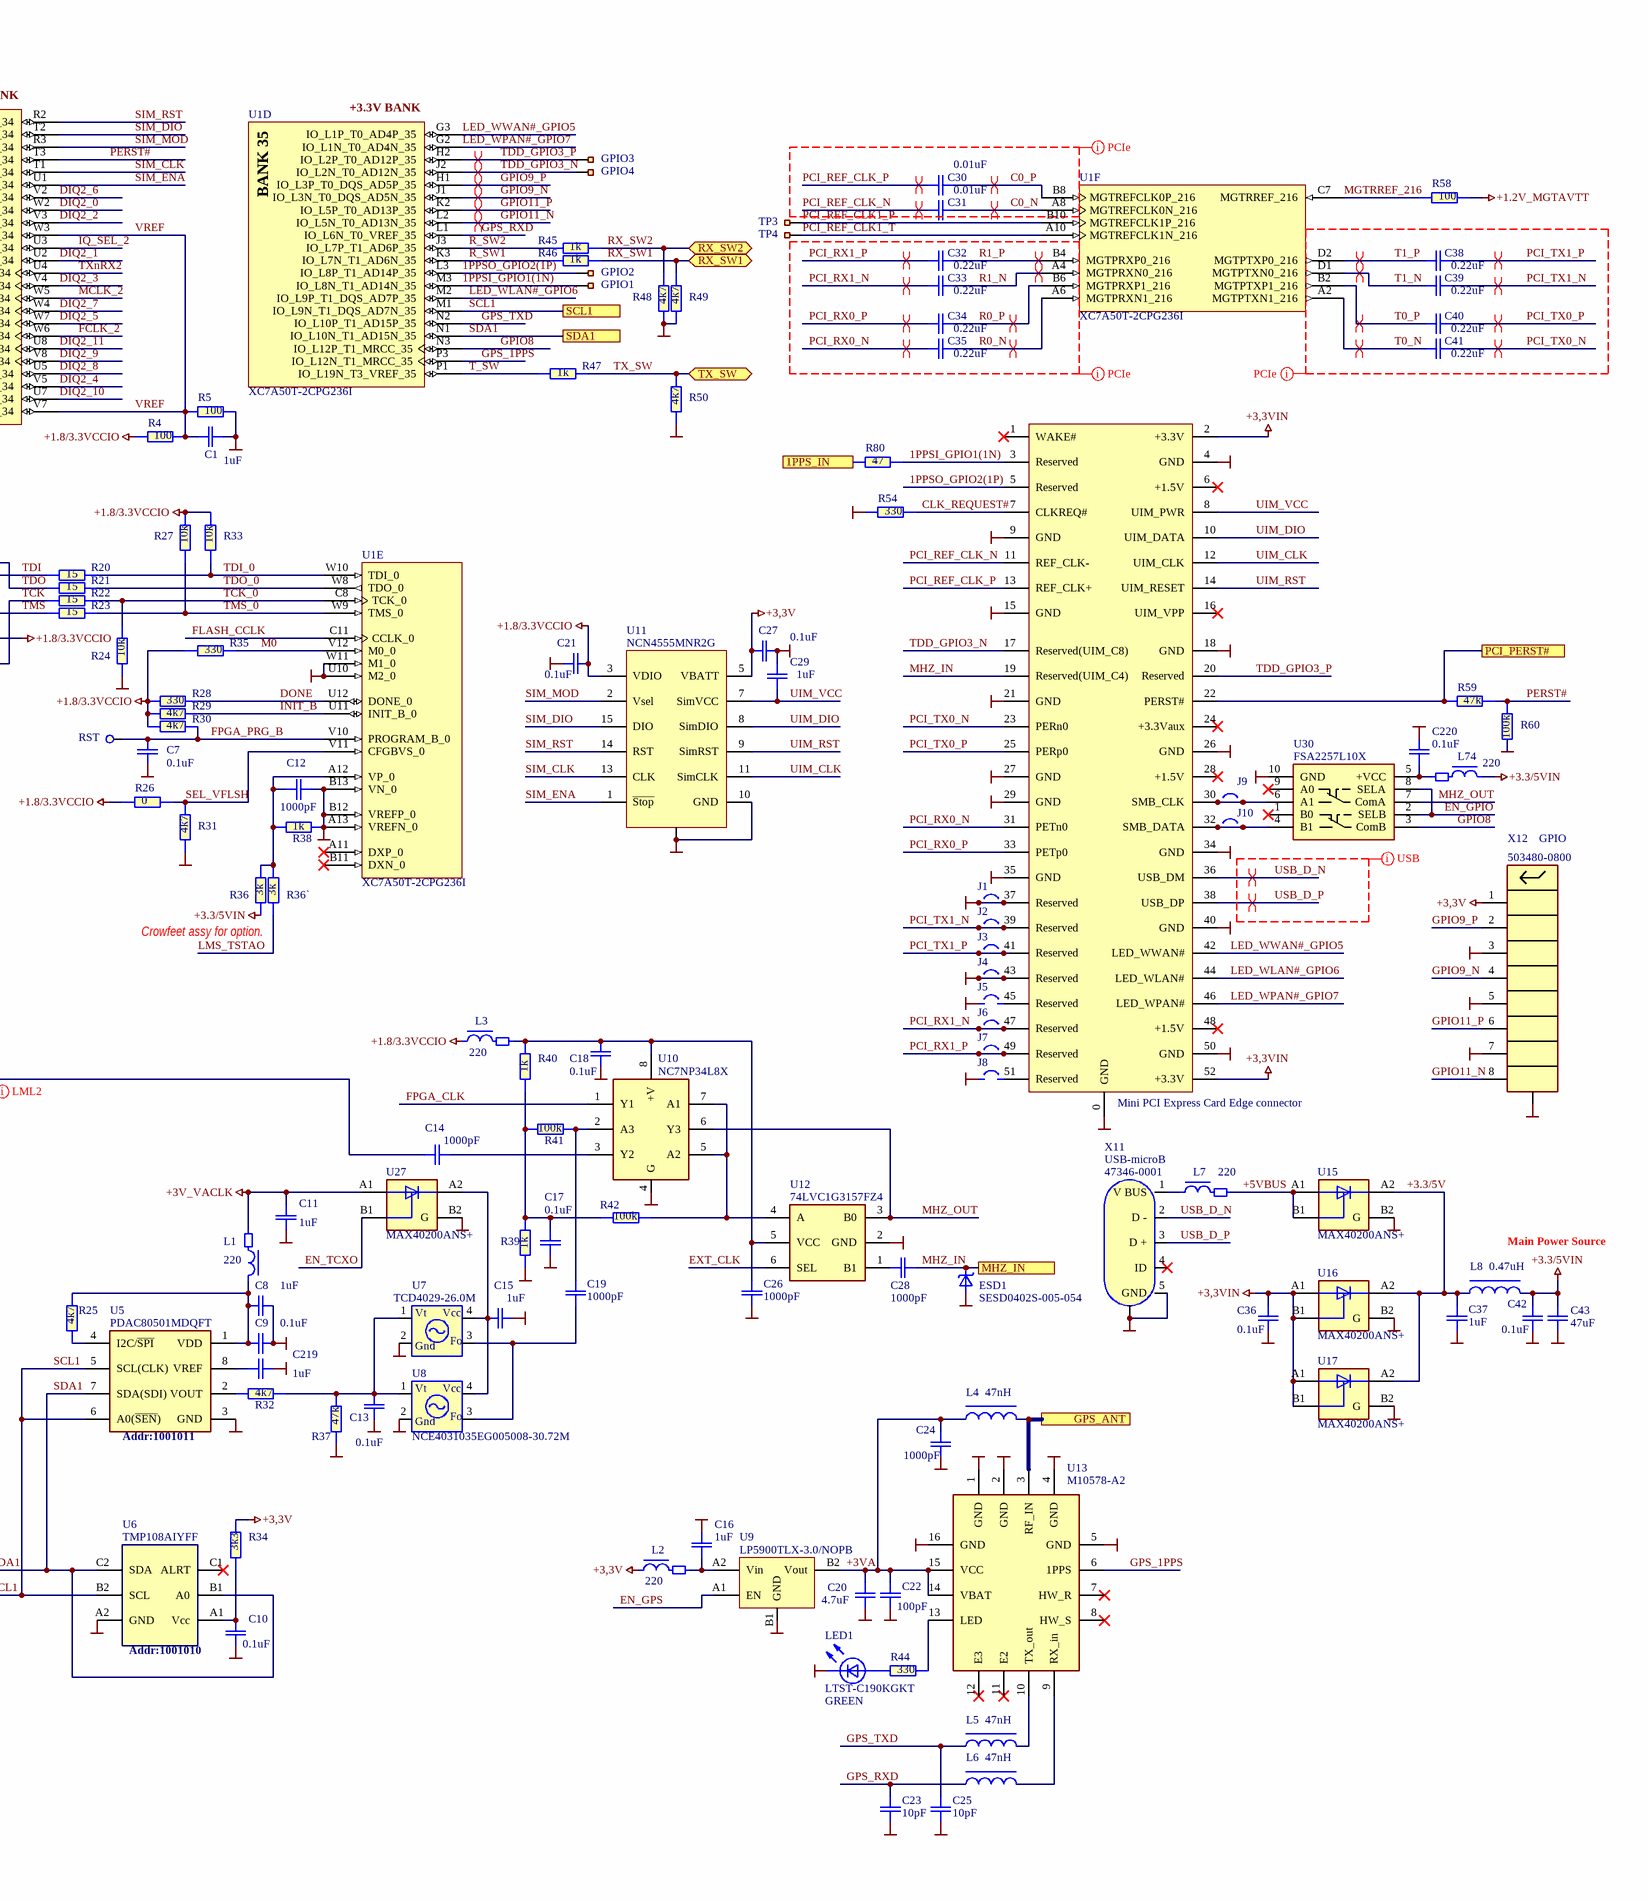
[diagram p3: FPGA.SchDoc, right]

### Parts
C1  1uF  [C0402-cirq]
C2  1uF  [C0402-cirq]
C3  1uF  [C0402-cirq]
C4  1uF  [C0402-cirq]
C5  1uF  [C0402-cirq]
C6  0.1uF  [C0402-cirq]
C7  0.1uF  [C0402-cirq]
C8  1uF  [C0402-cirq]
C9  0.1uF  [C0402-cirq]
C10  0.1uF  [C0402-cirq]
C11  1uF  [C0402-cirq]
C12  1000pF  [C0402-cirq]
C13  0.1uF  [C0402-cirq]
C14  1000pF  [C0402-cirq]
C15  1uF  [C0402-cirq]
C16  1uF  [C0402-cirq]
C17  0.1uF  [C0402-cirq]
C18  0.1uF  [C0402-cirq]
C19  1000pF  [C0402-cirq]
C20  4.7uF  [C0402-cirq]
C21  0.1uF  [C0402-cirq]
C22  100pF  [C0402-cirq]
C23  10pF  [C0402-cirq]
C24  1000pF  [C0402-cirq]
C25  10pF  [C0402-cirq]
C26  1000pF  [C0402-cirq]
C27  0.1uF  [C0402-cirq]
C28  1000pF  [C0402-cirq]
C29  1uF  [C0402-cirq]
C30  0.01uF  [C0402-cirq]
C31  0.01uF  [C0402-cirq]
C32  0.22uF  [C0402-cirq]
C33  0.22uF  [C0402-cirq]
C34  0.22uF  [C0402-cirq]
C35  0.22uF  [C0402-cirq]
C36  0.1uF  [C0402-cirq]
C37  1uF  [C0402-cirq]
C38  0.22uF  [C0402-cirq]
C39  0.22uF  [C0402-cirq]
C40  0.22uF  [C0402-cirq]
C41  0.22uF  [C0402-cirq]
C42  0.1uF  [C0402-cirq]
C43  47uF  [C0603 tall]
C219  1uF  [C0402-cirq]
C220  0.1uF  [C0402-cirq]
ESD1  SESD0402S-005-054  [SESD0402-Phillips]
GPIO1  (no value)  [KP-C_d1mm]  (no BOM)
GPIO2  (no value)  [KP-C_d1mm]  (no BOM)
GPIO3  (no value)  [KP-C_d1mm]  (no BOM)
GPIO4  (no value)  [KP-C_d1mm]  (no BOM)
J1  (no value)  [Jumper solder]  (no BOM)
J2  (no value)  [Jumper solder]  (no BOM)
J3  (no value)  [Jumper solder]  (no BOM)
J4  (no value)  [Jumper solder]  (no BOM)
J5  (no value)  [Jumper solder]  (no BOM)
J6  (no value)  [Jumper solder]  (no BOM)
J7  (no value)  [Jumper solder]  (no BOM)
J8  (no value)  [Jumper solder]  (no BOM)
J9  (no value)  [Jumper solder]  (no BOM)
J10  (no value)  [Jumper solder]  (no BOM)
L1  220  [BEAD0402-Phillips]
L2  220  [BEAD0402-Phillips]
L3  220  [BEAD0402-Phillips]
L4  47nH  [COIL0402-Phillips]
L5  47nH  [COIL0402-Phillips]
L6  47nH  [COIL0402-Phillips]
L7  220  [BEAD0402-Phillips]
L8  0.47uH  [L-VLS201610HBX]
L74  220  [BEAD0402-Phillips]
LED1  LTST-C190KGKT  Misc: GREEN  [LED-0603GR]
LED2  LTST-C190KGKT  Misc: GREEN  [LED-0603GR]
R1  10k 1%  [R0402-Phillips]
R2  15  [R0402-Phillips]
R3  15  [R0402-Phillips]
R4  100  [R0402-Phillips]
R5  100  [R0402-Phillips]
R6  0  [R0402-Phillips]
R7  20k  [R0402-Phillips]
R8  10k  [R0402-Phillips]
R9  8k06  [R0402-Phillips]
R10  15  [R0402-Phillips]
R11  15  [R0402-Phillips]
R12  4k7  [R0402-Phillips]
R13  4k7  [R0402-Phillips]
R14  4k7  [R0402-Phillips]
R15  47  [R0402-Phillips]
R16  15  [R0402-Phillips]
R17  15  [R0402-Phillips]
R18  15  [R0402-Phillips]
R19  4k7  [R0402-Phillips]
R20  15  [R0402-Phillips]
R21  15  [R0402-Phillips]
R22  15  [R0402-Phillips]
R23  15  [R0402-Phillips]
R24  10k  [R0402-Phillips]
R25  4k7  [R0402-Phillips]
R26  0  [R0402-Phillips]
R27  10k  [R0402-Phillips]
R28  330  [R0402-Phillips]
R29  4k7  [R0402-Phillips]
R30  4k7  [R0402-Phillips]
R31  4k7  [R0402-Phillips]
R32  4k7  [R0402-Phillips]
R33  10k  [R0402-Phillips]
R34  3k3  [R0402-Phillips]
R35  330  [R0402-Phillips]
R36  3k  [R0402-Phillips]
R36`  3k  [R0402-Phillips]
R37  47k  [R0402-Phillips]
R38  1k  [R0402-Phillips]
R39  1k  [R0402-Phillips]
R40  1k  [R0402-Phillips]
R41  100k  [R0402-Phillips]
R42  100k  [R0402-Phillips]
R43  330  [R0402-Phillips]
R44  330  [R0402-Phillips]
R45  1k  [R0402-Phillips]
R46  1k  [R0402-Phillips]
R47  1k  [R0402-Phillips]
R48  4k7  [R0402-Phillips]
R49  4k7  [R0402-Phillips]
R50  4k7  [R0402-Phillips]
R54  330  [R0402-Phillips]
R58  100  [R0402-Phillips]
R59  47k  [R0402-Phillips]
R60  100k  [R0402-Phillips]
R80  47  [R0402-Phillips]
R81  100  [R0402-Phillips]
R82  100  [R0402-Phillips]
R83  100  [R0402-Phillips]
R84  100  [R0402-Phillips]
R85  4k7  [R0402-Phillips]
RST  (no value)  [KP D1.5mm]  (no BOM)
TP1  (no value)  [KP-C_d1mm]  (no BOM)
TP2  (no value)  [KP-C_d1mm]  (no BOM)
TP3  (no value)  [KP-C_d1mm]  (no BOM)
TP4  (no value)  [KP-C_d1mm]  (no BOM)
TPA  (no value)  [KP D1.5mm]  (no BOM)
U1  XC7A50T-2CPG236I  [CPG236]  (parts A,B,C,D,E,F of 10)
U2  LMS7002M  [aQFN260(11.5x11.5mm)]  (parts A,C of 5)
U3  USB3333E-GL  [BGA WLCSP25]
U4  MT25QL256ABA8E12  [BGA T-BGA25 (6X8/1.0)]
U4'  MT25QL256ABA8E14  [BGA T-BGA24 (6X8/1.0)]
U5  PDAC80501MDQFT  [PWSON8 no PAD]
U6  TMP108AIYFF  [BGA WCSP6]
U7  TCD4029-26.0M  [TCXO5X3.2]
U8  NCE4031035EG005008-30.72M  [TCXO3.2X2.5]
U9  LP5900TLX-3.0/NOPB  [BGA DSBGA-4]
U10  NC7NP34L8X  [Micro pak 8 (1.6x1.6/0.5)]
U11  NCN4555MNR2G  [QFN16(3x3/0/5mm)-Case485AE]
U12  74LVC1G3157FZ4  [X2-DFN1410-6(1.4x1/0.5mm)]
U13  M10578-A2  [GPS_M10578-Ax]
U15  MAX40200ANS+  [BGA WLP4 (0.7x0.7/0.35)]
U16  MAX40200ANS+  [BGA WLP4 (0.7x0.7/0.35)]
U17  MAX40200ANS+  [BGA WLP4 (0.7x0.7/0.35)]
U27  MAX40200ANS+  [BGA WLP4 (0.7x0.7/0.35)]
U30  FSA2257L10X  [MICROPAK-10(2.1X1.6P0.5)]
X8  502598-1593  value RxADC  [Molex 502598-1593]
X9  JTAG  [Molex 78864-1001-Mating]  (no BOM)
X10  Mini PCI Express Card Edge connector  [PCIe MiniCard]  (no BOM)
X11  USB-microB  value 47346-0001  [USB-microB]
X12  503480-0800  value GPIO  [Molex 503480-0800]
X13  502598-1593  value TxDAC  [Molex 502598-1593]

### Ports
1PPS_IN, GPS_ANT, MHZ_IN, PCI_PERST#, RX_SW1 (bidir), RX_SW2 (bidir), SCL1, SCL2, SDA1, SDA2, TX_SW (bidir), VCC_SEL

### Nets
+1.2V_MGTAVTT: R58.2
+1.8/3.3VCCIO: C5.1 C6.2 C21.2 L3.1 R4.1 R12.2 R13.2 R14.2 R19.2 R26.1 R27.2 R28.1 R29.1 R30.1 R33.2 R35.1 U3.B3(VDDIO) U4.B4(Vcc) U4'.B4(Vcc) U11.3(VDIO) X9.4(VCC)
+3,3V: C27.2 L2.1 R34.2 U11.5(VBATT) X12.1
+3,3VIN: C36.2 U16.A1(VDD) U16.B1(EN) U17.A1(VDD) U17.B1(EN) X10.2(+3.3V) X10.52(+3.3V)
+3.3/5VIN: C2.2 C42.2 C43.1 L8.2 L74.1 R36.2 U3.C1(VBAT)
+3V_VACLK: C11.2 L1.2 U27.A1(VDD)
GND: C1.1 C2.1 C3.1 C4.1 C5.2 C6.1 C7.1 C8.1 C9.1 C10.2 C11.1 C12.1 C13.1 C15.1 C16.1 C17.2 C18.2 C20.2 C21.1 C22.1 C23.1 C24.1 C25.1 C26.2 C27.1 C29.2 C36.1 C37.2 C42.1 C43.2 C219.1 C220.1 ESD1.2(A) J1.1 J1.2 J4.1 J4.2 J5.2 J8.2 LED1.1(K) LED2.1(K) R1.2 R5.2 R7.1 R9.2 R24.1 R31.2 R37.2 R38.2 R39.1 R48.1 R49.1 R50.1 R54.1 R60.1 R85.1 U1.A13(VREFN_0) U1.B12(VREFP_0) U1.B13(VN_0) U1.E18(IO_L3P_T0_DQS_PUDC_B_14) U1.U10(M2_0) U1.W11(M1_0) U3.C3(GND) U4.B3(VSS) U4'.B3(VSS) U5.3(GND) U6.A2(GND) U7.2(GND) U8.2(GND) U9.B1(GND) U10.4(G) U11.0(GND) U11.10(GND) U12.2(GND) U13.1(GND) U13.2(GND) U13.4(GND) U13.5(GND) U13.16(GND) U15.B2(G) U16.B2(G) U17.B2(G) U27.B2(G) U30.10(GND) X8.0 X8.1 X8.4 X8.7 X8.9 X8.12 X8.15 X9.6(GND) X10.0(GND) X10.4(GND) X10.9(GND) X10.15(GND) X10.18(GND) X10.21(GND) X10.26(GND) X10.27(GND) X10.29(GND) X10.34(GND) X10.35(GND) X10.37(Reserved) X10.40(GND) X10.43(Reserved) X10.50(GND) X11.0(GND) X11.5(GND) X12.0 X12.3 X12.5 X12.7 X13.0 X13.1 X13.4 X13.7 X13.9 X13.12 X13.15
1PPS_IN: R80.1 ; port 1PPS_IN
1PPSI_GPIO1(1N): GPIO1.1 R80.2 U1.M3(IO_L8N_T1_AD14N_35) X10.3(Reserved)
1PPSO_GPIO2(1P): GPIO2.1 U1.L3(IO_L8P_T1_AD14P_35) X10.5(Reserved)
+3.3/5V: C37.1 L8.1 U15.A2(OUT) U16.A2(OUT) U17.A2(OUT)
+3VA: C20.1 C22.2 C24.2 L4.1 U9.B2(Vout) U13.14(VBAT) U13.15(VCC)
+5VBUS: L7.2 R8.1 U15.A1(VDD) U15.B1(EN)
ADC1I_N: R81.2 U2.U5(ADCININ_1) X8.3
ADC1I_P: R81.1 U2.V4(ADCINIP_1) X8.2
ADC1Q_N: R82.2 U2.W3(ADCINQN_1) X8.6
ADC1Q_P: R82.1 U2.Y2(ADCINQP_1) X8.5
ADC2I_N: R83.2 U2.V6(ADCININ_2) X8.11
ADC2I_P: R83.1 U2.AA1(ADCINIP_2) X8.10
ADC2Q_N: R84.2 U2.Y4(ADCINQN_2) X8.14
ADC2Q_P: R84.1 U2.AA3(ADCINQP_2) X8.13
C0_N: C31.2 U1.A8(MGTREFCLK0N_216)
C0_P: C30.2 U1.B8(MGTREFCLK0P_216)
CLK_REQUEST#: R54.2 X10.7(CLKREQ#)
DAC1I_N: U2.P2(TXININ_1) X13.3
DAC1I_P: U2.R3(TXINIP_1) X13.2
DAC1Q_N: U2.R5(TXINQN_1) X13.6
DAC1Q_P: U2.T4(TXINQP_1) X13.5
DAC2I_N: U2.U1(TXININ_2) X13.11
DAC2I_P: U2.U3(TXINIP_2) X13.10
DAC2Q_N: U2.T6(TXINQN_2) X13.14
DAC2Q_P: U2.V2(TXINQP_2) X13.13
DIQ1_0: U1.J19(IO_L6N_T0_D08_VREF_14) U2.AG31(DIQ1_0)
DIQ1_1: U1.H17(IO_L5P_T0_D06_14) U2.AF30(DIQ1_1)
DIQ1_2: U1.G17(IO_L5N_T0_D07_14) U2.AF34(DIQ1_2)
DIQ1_3: U1.K17(IO_L12N_T1_MRCC_14) U2.AE31(DIQ1_3)
DIQ1_4: U1.H19(IO_L4P_T0_D04_14) U2.AD30(DIQ1_4)
DIQ1_5: U1.U16(IO_L23N_T3_A02_D18_14) U2.AC29(DIQ1_5)
DIQ1_6: U1.J17(IO_L7P_T1_D09_14) U2.AE33(DIQ1_6)
DIQ1_7: U1.P19(IO_L10P_T1_D14_14) U2.AD32(DIQ1_7)
DIQ1_8: U1.U17(IO_L18P_T2_A12_D28_14) U2.AC31(DIQ1_8)
DIQ1_9: U1.N19(IO_L9N_T1_DQS_D13_14) U2.AC33(DIQ1_9)
DIQ1_10: U1.V15(IO_L21P_T3_DQS_14) U2.AB30(DIQ1_10)
DIQ1_11: U1.V16(IO_L19P_T3_A10_D26_14) U2.AB32(DIQ1_11)
DIQ2_0: U1.W2(IO_L5N_T0_34) U2.H30(DIQ2_0)
DIQ2_1: U1.U2(IO_L9N_T1_DQS_34) U2.J31(DIQ2_1)
DIQ2_2: U1.V3(IO_L6P_T0_34) U2.K30(DIQ2_2)
DIQ2_3: U1.V4(IO_L11N_T1_SRCC_34) U2.K32(DIQ2_3)
DIQ2_4: U1.V5(IO_L16N_T2_34) U2.L31(DIQ2_4)
DIQ2_5: U1.W7(IO_L13P_T2_MRCC_34) U2.K34(DIQ2_5)
DIQ2_6: U1.V2(IO_L5P_T0_34) U2.M30(DIQ2_6)
DIQ2_7: U1.W4(IO_L12N_T1_MRCC_34) U2.M32(DIQ2_7)
DIQ2_8: U1.U5(IO_L16P_T2_34) U2.N31(DIQ2_8)
DIQ2_9: U1.V8(IO_L14N_T2_SRCC_34) U2.N33(DIQ2_9)
DIQ2_10: U1.U7(IO_L19P_T3_34) U2.P30(DIQ2_10)
DIQ2_11: U1.U8(IO_L14P_T2_SRCC_34) U2.P32(DIQ2_11)
DONE: R28.2 U1.U12(DONE_0)
EN_GPIO: U1.D17(IO_0_14) U30.2(SELB) U30.8(SELA)
EN_GPS: U1.L18(IO_L8P_T1_D11_14) U9.A1(EN)
EN_TCXO: U1.R19(IO_L10N_T1_D15_14) U27.B1(EN)
EXT_CLK: U1.V17(IO_L19N_T3_A09_D25_VREF_14) U12.6(SEL)
FCLK_1: R2.1 U1.G19(IO_L4N_T0_D05_14)
FCLK_2: R3.2 U1.W6(IO_L13N_T2_MRCC_34)
FLASH_CCLK: U1.C11(CCLK_0) U4.B2(C) U4'.B2(C)
FLASH_D0: R18.1 U1.D18(IO_L1P_T0_D00_MOSI_14)
FLASH_D1: R10.2 U1.D19(IO_L1N_T0_D01_DIN_14)
FLASH_D2: R11.2 U1.G18(IO_L2P_T0_D02_14)
FLASH_D3: R17.1 U1.F18(IO_L2N_T0_D03_14)
FLASH_FCS_B: R12.1 U1.K19(IO_L6P_T0_FCS_B_14) U4.C2(S#) U4'.C2(S#)
FPGA_CLK: U1.N17(IO_L13P_T2_MRCC_14) U10.1(Y1)
FPGA_PRG_B: C7.2 R30.2 RST.1 U1.V10(PROGRAM_B_0)
GPIO8: U1.N3(IO_L12P_T1_MRCC_35) U30.3(ComB)
GPIO9_N: U1.J1(IO_L3N_T0_DQS_AD5N_35) X12.4
GPIO9_P: U1.H1(IO_L3P_T0_DQS_AD5P_35) X12.2
GPIO11_N: U1.L2(IO_L5N_T0_AD13N_35) X12.8
GPIO11_P: U1.K2(IO_L5P_T0_AD13P_35) X12.6
GPIO13: U1.T17(IO_L17P_T2_A14_D30_14) X8.8 X13.8
GPS_1PPS: U1.P3(IO_L12N_T1_MRCC_35) U13.6(1PPS)
GPS_ANT: L4.2 U13.3(RF_IN) ; port GPS_ANT
GPS_RXD: C23.2 L6.1 U1.L1(IO_L6N_T0_VREF_35)
GPS_TXD: C25.2 L5.1 U1.N2(IO_L10P_T1_AD15P_35)
INIT_B: R29.2 U1.U11(INIT_B_0)
IQ_SEL_1: U1.P17(IO_L13N_T2_MRCC_14) U2.Y32(IQ1_SEL)
IQ_SEL_2: U1.U3(IO_L9P_T1_DQS_34) U2.R33(IQ2_SEL)
LED: R43.1 U1.N18(IO_L9P_T1_DQS_14)
LED_WLAN#_GPIO6: U1.M2(IO_L9P_T1_DQS_AD7P_35) X10.44(LED_WLAN#)
LED_WPAN#_GPIO7: U1.G2(IO_L1N_T0_AD4N_35) X10.46(LED_WPAN#)
LED_WWAN#_GPIO5: U1.G3(IO_L1P_T0_AD4P_35) X10.42(LED_WWAN#)
LMS_LDO_EN: U1.W17(IO_L20N_T3_A07_D23_14) U2.U33(CORE_LDO_EN)
LMS_MISO: U1.W15(IO_L21N_T3_DQS_A06_D22_14) U2.F28(SDO)
LMS_MOSI: U1.W16(IO_L20P_T3_A08_D24_14) U2.F30(SDIO)
LMS_nRST: U1.U19(IO_L15P_T2_DQS_RDWR_B_14) U2.E27(~{RESET})
LMS_SCLK: U1.W14(IO_L22N_T3_A04_D20_14) U2.C29(SCLK)
LMS_SEN: U1.W13(IO_L22P_T3_A05_D21_14) U2.D28(SEN)
LMS_TST1: TP1.1 U2.D22(TSTDO-1)
LMS_TST2: TP2.1 U2.F22(TSTDO-2)
LMS_TSTAO: R36`.2 TPA.1 U2.B22(TSTAO)
M0: R35.2 U1.V12(M0_0)
MCLK_1: U1.L17(IO_L12P_T1_MRCC_14) U2.AB34(MCLK1)
MCLK_2: U1.W5(IO_L12P_T1_MRCC_34) U2.P34(MCLK2)
MGTRREF_216: R58.1 U1.C7(MGTRREF_216)
MHZ_IN: C28.2 ESD1.1(K) X10.19(Reserved(UIM_C4)) ; port MHZ_IN
MHZ_OUT: U10.6(Y3) U12.3(B0) U30.7(ComA)
OPTION: R19.1 R85.2 U1.V14(IO_L24N_T3_A00_D16_14)
PCI_PERST#: R59.1 X10.22(PERST#) ; port PCI_PERST#
PCI_REF_CLK1_P: TP3.1 U1.B10(MGTREFCLK1P_216)
PCI_REF_CLK1_Т: TP4.1 U1.A10(MGTREFCLK1N_216)
PCI_REF_CLK_N: C31.1 X10.11(REF_CLK-)
PCI_REF_CLK_P: C30.1 X10.13(REF_CLK+)
PCI_RX0_N: C35.1 X10.31(PETn0)
PCI_RX0_P: C34.1 X10.33(PETp0)
PCI_RX1_N: C33.1 J6.1 J6.2 X10.47(Reserved)
PCI_RX1_P: C32.1 J7.1 J7.2 X10.49(Reserved)
PCI_TX0_N: C41.2 X10.23(PERn0)
PCI_TX0_P: C40.2 X10.25(PERp0)
PCI_TX1_N: C39.2 J2.1 J2.2 X10.39(Reserved)
PCI_TX1_P: C38.2 J3.1 J3.2 X10.41(Reserved)
PERST#: R59.2 R60.2 U1.T3(IO_L2N_T0_34)
PLL_CLK: C14.2 R15.2
R0_N: C35.2 U1.A6(MGTPRXN1_216)
R0_P: C34.2 U1.B6(MGTPRXP1_216)
R1_N: C33.2 U1.A4(MGTPRXN0_216)
R1_P: C32.2 U1.B4(MGTPRXP0_216)
R_SW1: R46.1 U1.K3(IO_L7N_T1_AD6N_35)
R_SW2: R45.1 U1.J3(IO_L7P_T1_AD6P_35)
RX_EN: U1.W18(IO_L16P_T2_CSI_B_14) U2.V34(RX_EN)
RX_SW1: R46.2 R49.2 ; port RX_SW1
RX_SW2: R45.2 R48.2 ; port RX_SW2
SCL1: U1.M1(IO_L9N_T1_DQS_AD7N_35) U5.5(SCL(CLK)) U5.6(A0(~{SEN})) U6.B2(SCL) ; port SCL1
SCL2: U1.U14(IO_25_14) ; port SCL2
SDA1: U1.N1(IO_L10N_T1_AD15N_35) U5.7(SDA(SDI)) U6.B1(A0) U6.C2(SDA) ; port SDA1
SDA2: U1.U15(IO_L23P_T3_A03_D19_14) ; port SDA2
SEL_VFLSH: R26.2 R31.1 U1.V11(CFGBVS_0)
SIM_CLK: U1.T1(IO_L3P_T0_DQS_34) U11.13(CLK)
SIM_DIO: U1.T2(IO_L1N_T0_34) U11.15(DIO)
SIM_ENA: U1.U1(IO_L3N_T0_DQS_34) U11.1(~{Stop})
SIM_MOD: U1.R3(IO_L2P_T0_34) U11.2(Vsel)
SIM_RST: U1.R2(IO_L1P_T0_34) U11.14(RST)
T0_N: C41.1 U1.A2(MGTPTXN1_216)
T0_P: C40.1 U1.B2(MGTPTXP1_216)
T1_N: C39.1 U1.D1(MGTPTXN0_216)
T1_P: C38.1 U1.D2(MGTPTXP0_216)
T_SW: R47.1 U1.P1(IO_L19N_T3_VREF_35)
TCK: R22.1 X9.5(TCK)
TCK_0: R22.2 R24.2 U1.C8(TCK_0)
TDD_GPIO3_N: GPIO4.1 U1.J2(IO_L2N_T0_AD12N_35) X10.17(Reserved(UIM_C8))
TDD_GPIO3_P: GPIO3.1 U1.H2(IO_L2P_T0_AD12P_35) X10.20(Reserved)
TDI: R20.1 X9.2(TDI)
TDI_0: R20.2 R33.1 U1.W10(TDI_0)
TDO: R21.1 X9.1(TDO)
TDO_0: R21.2 U1.W8(TDO_0)
TMS: R23.1 X9.3(TMS)
TMS_0: R23.2 R27.1 U1.W9(TMS_0)
TX_EN: U1.W19(IO_L16N_T2_A15_D31_14) U2.U29(TX_EN)
TX_SW: R47.2 R50.2 ; port TX_SW
TXnRX1: U1.M19(IO_L11N_T1_SRCC_14) U2.V32(TX/~{RX}1)
TXnRX2: U1.U4(IO_L11P_T1_SRCC_34) U2.U31(TX/~{RX}2)
UIM_CLK: U11.11(SimCLK) X10.12(UIM_CLK)
UIM_DIO: U11.8(SimDIO) X10.10(UIM_DATA)
UIM_RST: U11.9(SimRST) X10.14(UIM_RESET)
UIM_VCC: C29.1 U11.7(SimVCC) X10.8(UIM_PWR)
USB_3.3V: C3.2 R6.1 U3.B1(ID) U3.D3(VDD3.3)
USB_26M: U1.E19(IO_L3N_T0_DQS_EMCCLK_14) U3.A2(REFCLK)
USB_CLK: R16.2 U1.C16(IO_L13P_T2_MRCC_16)
USB_D0: U1.B17(IO_L14N_T2_SRCC_16) U3.B4(DAT0)
USB_D1: U1.A17(IO_L12N_T1_MRCC_16) U3.C5(DAT1)
USB_D2: U1.B16(IO_L13N_T2_MRCC_16) U3.C4(DAT2)
USB_D3: U1.A16(IO_L12P_T1_MRCC_16) U3.D5(DAT3)
USB_D4: U1.B15(IO_L11N_T1_SRCC_16) U3.D4(DAT4)
USB_D5: U1.A15(IO_L6N_T0_VREF_16) U3.E5(DAT5)
USB_D6: U1.A14(IO_L6P_T0_16) U3.E4(DAT6)
USB_D7: U1.C15(IO_L11P_T1_SRCC_16) U3.E3(DAT7)
USB_D_N: U3.D1(DM) X10.36(USB_DM) X11.2(D_-)
USB_D_P: U3.E1(DP) X10.38(USB_DP) X11.3(D_+)
USB_DIR: U1.B18(IO_L19P_T3_16) U3.A4(DIR)
USB_NRST: U1.M18(IO_L11P_T1_SRCC_14) U3.C2(RESETB)
USB_NXT: U1.A18(IO_L19N_T3_VREF_16) U3.B5(NXT)
USB_STP: U1.C17(IO_L14P_T2_SRCC_16) U3.A3(STP)
VCC_SEL: U1.V19(IO_L15N_T2_DQS_DOUT_CSO_B_14) ; port VCC_SEL
VREF: C1.2 R4.2 R5.1 U1.V7(IO_L19N_T3_VREF_34) U1.W3(IO_L6N_T0_VREF_34)
NetC4_2: C4.2 U3.B2(VDD1.8)
NetC8_2: C8.2 C9.2 L1.1 R25.1 U5.1(VDD)
NetC10_1: C10.1 R34.1 U6.A1(Vcc)
NetC12_2: C12.2 R36.1 R36`.1 R38.1 U1.A12(VP_0)
NetC13_2: C13.2 R32.2 R37.1 U7.1(Vt) U8.1(Vt)
NetC14_1: C14.1 U10.3(Y2)
NetC15_2: C15.2 U7.4(VCC) U8.4(VCC) U27.A2(OUT)
NetC16_2: C16.2 L2.2 U9.A2(Vin)
NetC17_1: C17.1 R39.2 R40.1 R41.1 R42.2
NetC18_1: C18.1 C26.1 L3.2 R40.2 U10.8(+V) U12.5(VCC)
NetC19_1: C19.1 U7.3(Fo) U8.3(Fo)
NetC19_2: C19.2 R41.2 U10.2(A3)
NetC28_1: C28.1 U12.1(B1)
NetC219_2: C219.2 U5.8(VREF)
NetC220_2: C220.2 L74.2 U30.5(+VCC)
NetJ5_1: J5.1 X10.45(Reserved)
NetJ8_1: J8.1 X10.51(Reserved)
NetJ9_1: J9.1 J9.2 U30.6(A1) X10.30(SMB_CLK)
NetJ10_1: J10.1 J10.2 U30.4(B1) X10.32(SMB_DATA)
NetL5_2: L5.2 U13.10(TX_out)
NetL6_2: L6.2 U13.9(RX_in)
NetL7_1: L7.1 X11.1(V_BUS)
NetLED1_2: LED1.2(A) R44.1
NetLED2_2: LED2.2(A) R43.2
NetR1_1: R1.1 U2.F18(VR_10K)
NetR2_2: R2.2 U2.AA33(FCLK1)
NetR3_1: R3.1 U2.R29(FCLK2)
NetR6_2: R6.2 R7.2 U3.E2(REFSEL0)
NetR8_2: R8.2 U3.D2(VBUS)
NetR9_1: R9.1 U3.A1(RBIAS)
NetR10_1: R10.1 U4.D2(DQ1) U4'.D2(DQ1)
NetR11_1: R11.1 R13.1 U4.C4(DQ2) U4'.C4(DQ2)
NetR14_1: R14.1 R17.2 U4.D4(DQ3) U4'.D4(DQ3)
NetR15_1: R15.1 U2.E5(TXPLLCLK)
NetR16_1: R16.1 U3.A5(CLKOUT)
NetR18_2: R18.2 U4.D3(DQ0) U4'.D3(DQ0)
NetR25_2: R25.2 U5.4(I2C/~{SPI})
NetR32_1: R32.1 U5.2(VOUT)
NetR42_1: R42.1 U10.5(A2) U10.7(A1) U12.4(A)
NetR44_2: R44.2 U13.13(LED)

Not connected (* = marked no-connect by the designer): U1 A11(DXP_0)* B11(DXN_0)* J18(IO_L7N_T1_D10_14)* K18(IO_L8N_T1_D12_14)* P18(IO_L14P_T2_SRCC_14)* R18(IO_L14N_T2_SRCC_14)* T18(IO_L17N_T2_A13_D29_14)* U18(IO_L18N_T2_A11_D27_14)* V13(IO_L24P_T3_A01_D17_14)*; U2 AA5(RXOUTQN_1)* AB2(RXOUTIN_1)* AB4(RXOUTQP_1)* AB6(RXOUTQN_2)* AC3(RXOUTIN_2)* AC5(RXOUTQP_2)* AD2(RXOUTIP_2)* AM24(RXPLLCLK)* C27(SCL)* D26(SDA)* V30(LOGIC_RST)* Y6(RXOUTIP_1)*; U4 A4(RST#)*; U4' A4(RST#)*; U6 C1(ALRT)*; U13 7(HW_R)* 8(HW_S)* 11(E2)* 12(E3)*; U30 1(B0)* 9(A0)*; X10 1(WAKE#)* 6(+1.5V)* 16(UIM_VPP)* 24(+3.3Vaux)* 28(+1.5V)* 48(+1.5V)*; X11 4(ID)*

### Layout directives
differential pair: ADC1I_N, ADC1I_P, ADC1Q_N, ADC1Q_P, ADC2I_N, ADC2I_P, ADC2Q_N, ADC2Q_P, C0_N, C0_P, DAC1I_N, DAC1I_P, DAC1Q_N, DAC1Q_P, DAC2I_N, DAC2I_P, DAC2Q_N, DAC2Q_P, GPIO9_N, GPIO9_P, GPIO11_N, GPIO11_P, PCI_REF_CLK_N, PCI_REF_CLK_P, PCI_RX0_N, PCI_RX0_P, PCI_RX1_N, PCI_RX1_P, PCI_TX0_N, PCI_TX0_P, PCI_TX1_N, PCI_TX1_P, R0_N, R0_P, R1_N, R1_P, T0_N, T0_P, T1_N, T1_P, TDD_GPIO3_N, TDD_GPIO3_P, USB_D_N, USB_D_P
net class LML1; rule Width Constraint [Pref Width = 4mil    Min Width = 4mil    Max Width = 6.693mil]; rule Parallel Segment Constraint [Gap = 8mil    Limit = 200mil    Layer - Same Layer]; rule Maximum Via Count Constraint [Max Count = 2]; rule Fanout Control [Style - BGA    Direction - Alternating In and Out Via Grid = 1mil]; rule Clearance Constraint [Generic clearance = 4mil, and 3 value(s) for objects]: DIQ1_0, DIQ1_1, DIQ1_2, DIQ1_3, DIQ1_4, DIQ1_5, DIQ1_6, DIQ1_7, DIQ1_8, DIQ1_9, DIQ1_10, DIQ1_11, FCLK_1, IQ_SEL_1, MCLK_1
net class LML2; rule Width Constraint [Pref Width = 4mil    Min Width = 4mil    Max Width = 6.693mil]; rule Parallel Segment Constraint [Gap = 8mil    Limit = 200mil    Layer - Same Layer]; rule Maximum Via Count Constraint [Max Count = 2]; rule Fanout Control [Style - BGA    Direction - Alternating In and Out Via Grid = 1mil]; rule Clearance Constraint [Generic clearance = 4mil, and 3 value(s) for objects]: DIQ2_0, DIQ2_1, DIQ2_2, DIQ2_3, DIQ2_4, DIQ2_5, DIQ2_6, DIQ2_7, DIQ2_8, DIQ2_9, DIQ2_10, DIQ2_11, FCLK_2, IQ_SEL_2, MCLK_2
net class USB: USB_D_N, USB_D_P
net class PCIe: C0_N, C0_P, PCI_REF_CLK_N, PCI_REF_CLK_P, PCI_RX0_N, PCI_RX0_P, PCI_RX1_N, PCI_RX1_P, PCI_TX0_N, PCI_TX0_P, PCI_TX1_N, PCI_TX1_P, R0_N, R0_P, R1_N, R1_P, T0_N, T0_P, T1_N, T1_P

### Notes on the sheet
- (near U1) +1.8/3.3V BANK
- (near U1) +3.3V BANK
- (near U1) BOOT from FLASH
- DEVICE
- Crowfeet assy for option.
- Main Power Source
- (near U5) Addr:1001011
- Addr:1001010
- (in symbol TCVCXO_2.5x3.2) Vcc; Gnd
- (in symbol TCVCXO_5x3.2) Vcc; Gnd
- (in symbol XC7A35T-2CPG236C, part A) BANK 14
- (in symbol XC7A35T-2CPG236C, part B) BANK 16
- (in symbol XC7A35T-2CPG236C, part C) BANK 34
- (in symbol XC7A35T-2CPG236C, part D) BANK 35

### Library data of the parts
C1-C5 C8 C11 C15 C16 C29 C37 C219 = C0402: as C74 on sheet PwrAndBias; Value: 1uF; Link: https://octopart.com/search?avg_avail=(1__*)&q=1uF%20%20x5r%200402&specs2.76.numbers=1e-06&start=0&oq=1uF%20%20x5r%200402
C6 C7 C9 C10 C13 C17 C18 C21 C27 C36 C42 C220 = C0402: as C44 on sheet PwrAndBias; Value: 0.1uF; Link: https://octopart.com/search?avg_avail=%281__%2A%29&q=GRM155+x7r+0.1uf+0402&r=sp&s=NUEPno7bQ4qfu1XPud9uDg&start=10
C12 C14 C19 C24 C26 C28 = C0402: as C78 on sheet PwrAndBias; Value: 1000pF; Link: https://octopart.com/search?avg_avail=(1__*)&q=1000PF%20C0G%20NP0%200402&start=0
C20 = C0402: as C54 on sheet PwrAndBias; Value: 4.7uF; Link: https://octopart.com/search?avg_avail=(1__*)&q=4.7uf%200402&start=0&specs2.76.numbers=4.7e-06
C22 C23 C25 = C0402: Capacitor; Manufacturer: Any; Tolerance: 20%; Name: SMD0402; U/P/TKE: C0G 50V
  C22: Value: 100pF; Link: https://octopart.com/search?avg_avail=(1__*)&q=100pF%20%20C0G%20NP0%20%2050V%200402&start=0&oq=100pF%20%20C0G%20NP0%20%2050V%200402
  C23 C25: Value: 10pF; Link: https://octopart.com/search?avg_avail=(1__*)&q=10pF%20%20C0G%20NP0%20%2050V%200402&start=0
C30 C31 = C0402: Capacitor; Manufacturer: Any; Tolerance: 10%; Name: SMD0402; U/P/TKE: X7R; Value: 0.01uF; Link: https://octopart.com/search?r=sp&s=NUEPno7bQ4qfu1XPud9uDg&q=10000PF%20X7R%200402&oq=10000PF%20X7R%200402&start=0&avg_avail=(1__*)
C32-C35 C38-C41 = C0402: as C127 on sheet PwrAndBias; Value: 0.22uF; Link: https://octopart.com/search?avg_avail=(1__*)&q=x5r%200.22uf%200402&r=sp&s=NUEPno7bQ4qfu1XPud9uDg&start=0&oq=x5r%200.22uf%200402
C43 = C0603-TALL: Capacitor; Manufacturer: MuRata; Tolerance: 20%; Name: ZRB18AR60J476ME01L; U/P/TKE: X5R 4V; Value: 47uF; Link: https://octopart.com/zrb18ar60j476me01l-murata-71221023?r=sp&s=AX1jIhZnRzqCJDNKo8E3Og
ESD1 = SESD0402S: ESD diod unidirectional; Manufacturer: Tyco Electronics Corp; U/P/TKE: 5.4V; Name: SESD0402S-005-054; Link: https://octopart.com/search?q=SESD0402S-005-054
GPIO1-GPIO4 TP1-TP4 = KP40X40: Manufacturer: PCB
J1-J10 = JUMPER PCB: Manually soldered jumper; Manufacturer: DIY
L1-L3 L7 L74 = EMI BLM15: as L9 on sheet PwrAndBias; Value: 220; Link: https://octopart.com/blm15eg221sn1d-murata-368376
L4-L6 = L-LQW15: Coil wire wound; Manufacturer: MuRata; Tolerance: ±5%; Name: LQW15AN47NJ; Value: 47nH; Link: https://octopart.com/lqw15an47nj00d-murata-387459
L8 = L-VLS20161xHBX-1: as L13 on sheet PwrAndBias; Value: 0.47uH; Link: https://octopart.com/vls201610hbx-r47m-1-tdk-52458594
LED1 LED2 = LED0603GR_Lite-On: LED GREEN; Manufacturer: Lite-On Inc; U/P/TKE: 40mcd, 2V/20mA, -30+85°C; Name: LTST-C190KGKT; Link: https://octopart.com/ltst-c190kgkt-lite-on-549897
R1 = R0402: Resistor; Manufacturer: BOURNS; Name: CR0402-JW; U/P/TKE: 50V/60mW/200ppm; Tolerance: 1%; Value: 10k 1%
R2-R8 R10-R36 R36` R37-R50 R54 R59 R60 R80 R85 = R0402: as R61 on sheet PwrAndBias
  R2 R3 R10 R11 R16-R18 R20-R23: Value: 15
  R4 R5: Value: 100
  R6 R26: Value: 0
  R7: Value: 20k
  R8 R24 R27 R33: Value: 10k
  R12-R14 R19 R25 R29-R32 R48-R50 R85: Value: 4k7
  R15 R80: Value: 47
  R28 R35 R43 R44 R54: Value: 330
  R34: Value: 3k3
  R36 R36`: Value: 3k
  R37 R59: Value: 47k
  R38-R40 R45-R47: Value: 1k
  R41 R42 R60: Value: 100k
R9 = R0402: Resistor; Manufacturer: Panasonic; Tolerance: 0.5%; Name: ERJ-2RKF8061X; U/P/TKE: 50V/60mW/100ppm; Value: 8k06; Link: https://octopart.com/erj-2rkf8061x-panasonic-55421298
R58 R81-R84 = R0402: Resistor; Manufacturer: BOURNS; Tolerance: 1%; Name: CR0402-JW; U/P/TKE: 50V/60mW/200ppm; Value: 100
RST TPA = KP-D1.5mm: Manufacturer: PCB
U1 = XC7A35T-2CPG236C: as U1 on sheet PwrAndBias; DatasheetVersion: v1.15; PackageVersion: Rev. 1.11; PackageReference: CPG-236; PackageDescription: 238-Ball Wire-Bond Chip-Scale BGA, Body 10 x10 mm, Pitch 0.5 mm; Maximum Distributed RAM: 400 Kb; Operating Temperature Range: Commercial; Speed Grades: 2; NexusDeviceID: XC7A35T-2CPG236C; Mounting Technology: Surface Mount; PartNumber: XC7A50T-2CPG236I; ComponentLink1Description: Manufacturer URL; ComponentLink1URL: http://www.xilinx.com/; ComponentLink2Description: Datasheet; ComponentLink2URL: http://www.xilinx.com/support/documentation/data_sheets/ds180_7Series_Overview.pdf; ComponentLink3Description: Package Specification; ComponentLink3URL: http://www.xilinx.com/support/documentation/user_guides/ug475_7Series_Pkg_Pinout.pdf; ComponentLink4Description: DC and Switching Characteristics; ComponentLink4URL: http://www.xilinx.com/support/documentation/data_sheets/ds181_Artix_7_Data_Sheet.pdf; ComponentLink5Description: Package File; ComponentLink5URL: http://www.xilinx.com/support/packagefiles/a7packages/xc7a200tsbg484pkg.txt; ComponentLink6Description: Packaging and Pinout; ComponentLink6URL: http://www.xilinx.com/support/documentation/user_guides/ug475_7Series_Pkg_Pinout.pdf
U2 = LMS7002M: as U2 on sheet PwrAndBias; Name: LMS7002M
U3 = USB3333E-GL: IC USB 2.0 FHY; Manufacturer: Microchip; Misc: USB 2.0 FHY ULPI BGA; Link: https://octopart.com/usb3333e-gl-tr-microchip-24995478; Name: USB3333E-GL
U4 = MT25QL(U)256_BGA-12: IC NOR FLASH; Manufacturer: Micron; U/P/TKE: 2.7-3.3V; Name: MT25QL256ABA8E12; Link: https://octopart.com/search?q=MT25QL256ABA8E12
U4' = MT25QL(U)256_BGA-14: IC NOR FLASH; Manufacturer: Micron; U/P/TKE: 2.7-3.3V; Name: MT25QL256ABA8E14; Link: https://octopart.com/search?q=MT25QL256ABA8E14
U5 = DAC80501: IC serial DAC; Manufacturer: TI; Misc: SPI/I2C 16-Bit DAC; Name: PDAC80501MDQFT; Link: https://octopart.com/pdac80501mdqft-texas+instruments-97302471; PDF: http://www.ti.com/product/dac80501
U6 = TMP108: IC Thermosensor; Manufacturer: TI; Misc: IC temperature sensor I2C, DSBGA-6; Name: TMP108AIYFF; Link: https://octopart.com/tmp108aiyffr-texas+instruments-28946339
U7 = TCVCXO_5x3.2: TCVCXO; Manufacturer: Pletronics; U/P/TKE: 2.5-3.3V/ClippedSIN/0,2ppm; Name: TCD4029-26.0M
U8 = TCVCXO_2.5x3.2: TCVCXO; Manufacturer: Pletronics; U/P/TKE: 1.8-3.3V/ClippedSIN/0,5ppm; Name: NCE4031035EG005008-30.72M
U9 = LP5900TL: IC; Manufacturer: TI; Misc: Ultra Low Noise LDO; Name: LP5900TLX-3.0/NOPB; Link: https://octopart.com/search?q=LP5900TLX-3.0&start=0
U10 = NC7NP34L8X: IC Triple Buffer; Manufacturer: Fairchild; U/P/TKE: Vcc 0.9-3.6V; Name: NC7NP34L8X; Link: https://octopart.com/nc7np34l8x-fairchild+semiconductor-425659
U11 = NCN4555MN: IC SIM Card buffer; Manufacturer: ON Semi; Name: NCN4555MNR2G; Link: https://octopart.com/ncn4555mnr2g-on+semiconductor-712660
U12 = 74LVC1G3157: IC SPDT switch; Manufacturer: Diodes; Swap: No; Misc: 1:2 Multiplexer, analog SPDT switch.; Name: 74LVC1G3157FZ4; Link: https://octopart.com/74lvc1g3157fz4-7-diodes+inc.-73278608
U13 = GPS_M10578-Ax: Module GPS resceiver; Manufacturer: Radionova (Antenova); Misc: GPS receiver module (A2 opt); Name: M10578-A2; Link: https://octopart.com/m10578-a2-antenova-71069728?r=sp&s=Oh_j1oz0Summ533Nx3cPvA
U15-U17 U27 = MAX40200ANS+: as U28 on sheet PwrAndBias; Name: MAX40200ANS+; Misc: IC ideal diode switch; Value: MAX40200ANS+; Link: https://octopart.com/max40200ans%2Bt-maxim+integrated-80998950
U30 = FSA2257L10X: IC dual SPDT bi-dir switch; Manufacturer: Fairchild; Misc: Analog SPDT Low R switch dual 1:2; U/P/TKE: 1.65-5.5V/3dB@200MHz; Name: FSA2257L10X; Link: https://octopart.com/fsa2257l10x-on+semiconductor-84328207; PDF: https://datasheet.octopart.com/FSA2257L10X-ON-Semiconductor-datasheet-85538665.pdf
X8 X13 = Conn Molex 502598-1593: Connector FFC/FPC; Manufacturer: Molex; Misc: Connector FFC/FPC 15pin side entry; U/P/TKE: 0.3A/50Vrms/-40~+105°C; Name: 502598-1593; Link: https://octopart.com/502598-1593-molex-71801460; PDF: https://www.molex.com/pdm_docs/sd/5025981593_sd.pdf
X9 = Conn Molex_788641001 mating: Connector for spring contacts; Manufacturer: PCB; Name: Molex 788641001; Misc: Mating to Molex 788641001 connector; Value: JTAG
X10 = PCIe MiniCard: PCIe MiniCard full or half size; System: Connector
X11 = USB-microB: Connector microUSB-B; Manufacturer: Molex; Name: USB-microB; Link: https://octopart.com/47346-0001-molex-7164928
X12 = Conn Molex 503480-0800 one: Connector FFC/FPC; Manufacturer: Molex; Misc: Connector FFC/FPC 8pin side entry; U/P/TKE: 0.5A/50Vrms/-40~+85°C; Name: 503480-0800; Link: https://octopart.com/5034800800-molex-18597066